# EAGLE design outdoor-sensor (EAGLE 7.4.0)

## Sheet 1 of 9: Pressure Sensor LPS25H Datasheet <http://www.st.com/st-web-ui/static/active/en/resource/technical/document/datasheet/DM00066332.pdf>
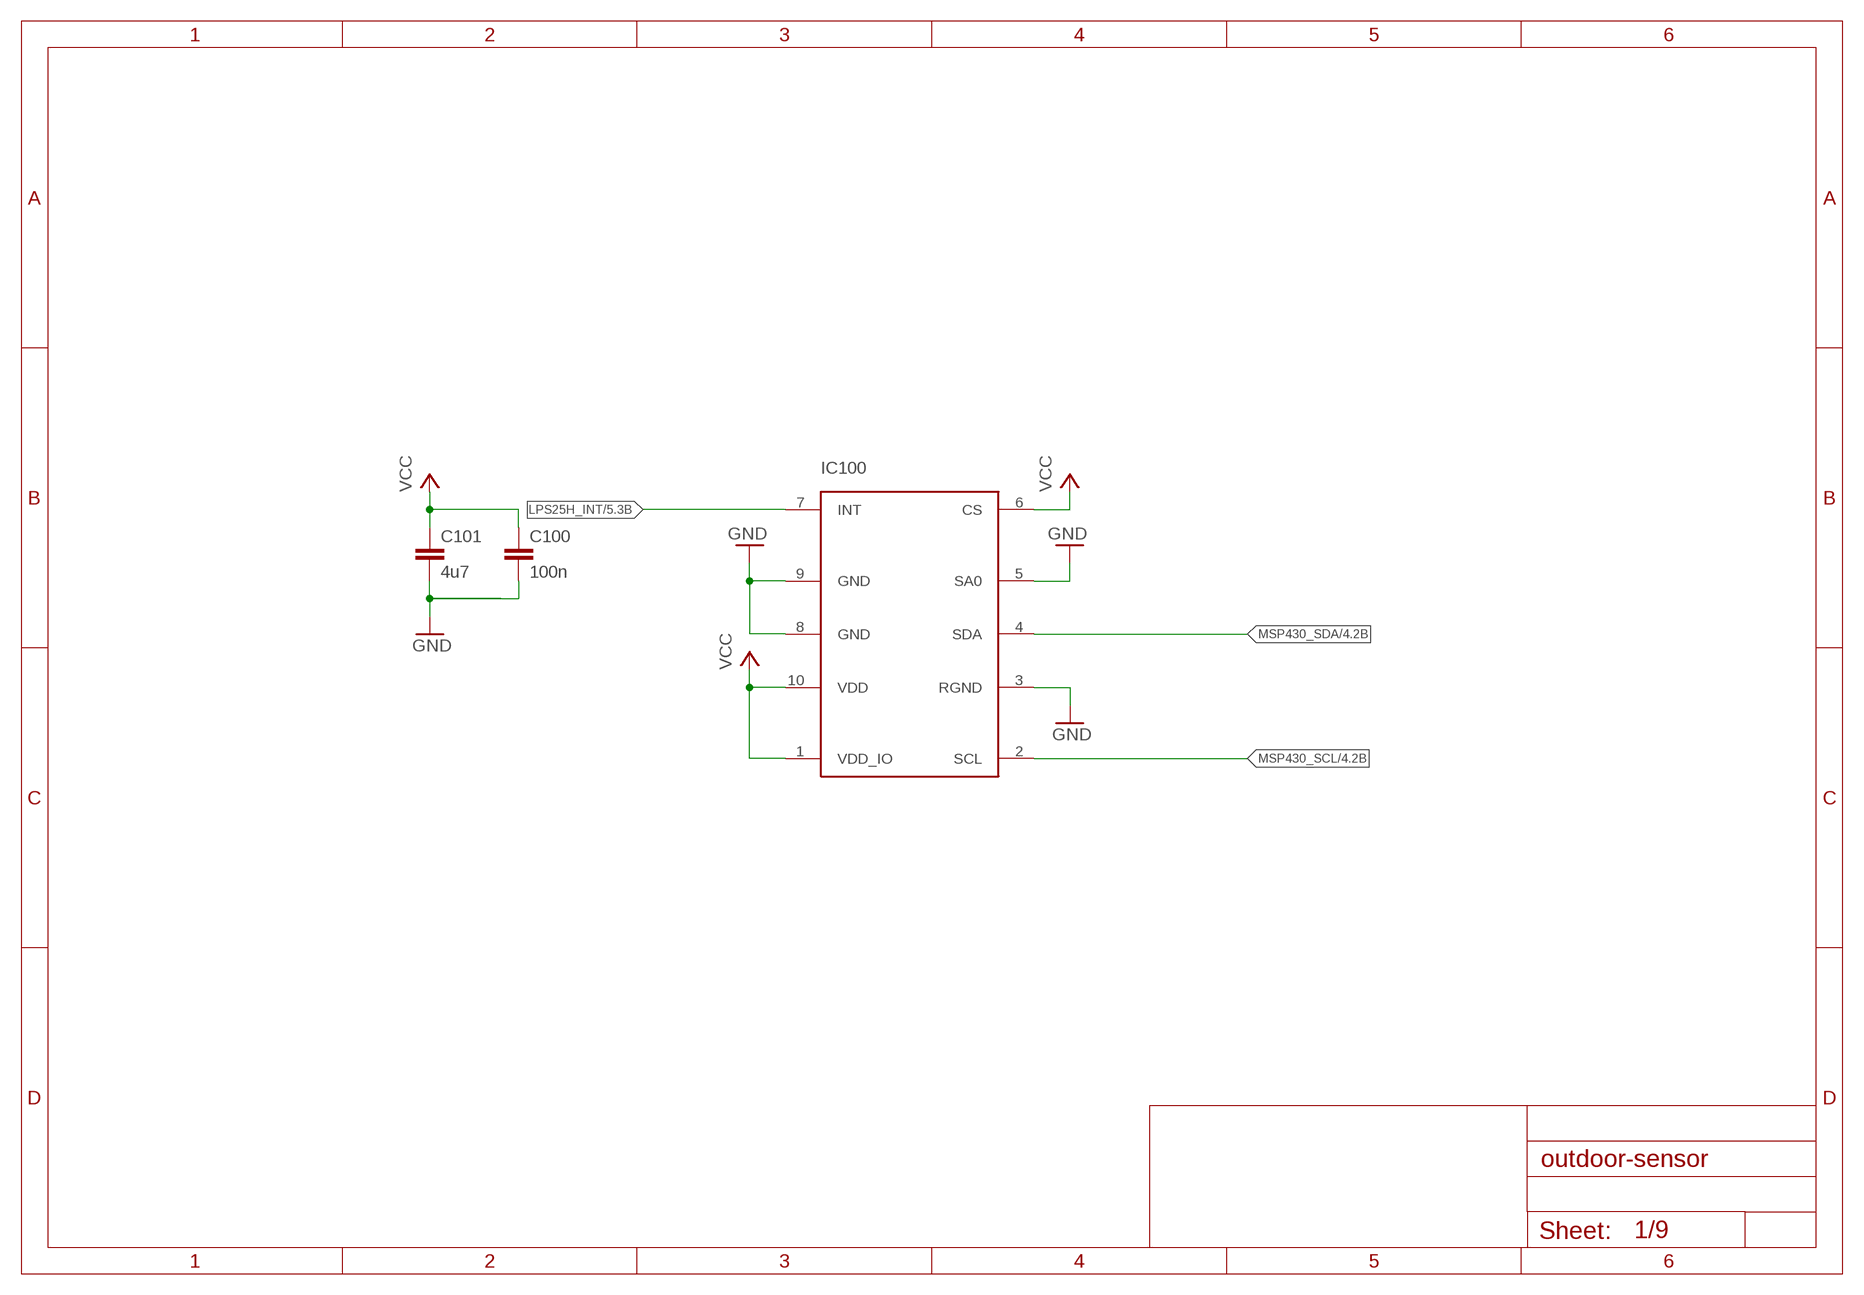
[diagram p0: schematic, sheet 1]

### Parts
C100  100n  C-EUC0603  [C0603]
C101  4u7  C-EUC0603  [C0603]
IC100  LPS25H  [LPS25H]

### Nets
GND: C100.2 C101.2 IC100.3(RGND) IC100.5(SA0) IC100.8(GND) IC100.9(GND) ; also sheet 2,3,4,5,6,7,8,9
LPS25H_INT: IC100.7(INT) ; also sheet 5
MSP430_SCL: IC100.2(SCL) ; also sheet 4,5,6,8,9
MSP430_SDA: IC100.4(SDA) ; also sheet 4,5,6,8,9
VCC: C100.1 C101.1 IC100.1(VDD_IO) IC100.6(CS) IC100.10(VDD) ; also sheet 2,3,4,5,6,8

## Sheet 2 of 9: Charger and Buck BQ25570 Datasheet <http://www.ti.com/lit/ds/symlink/bq25570.pdf>
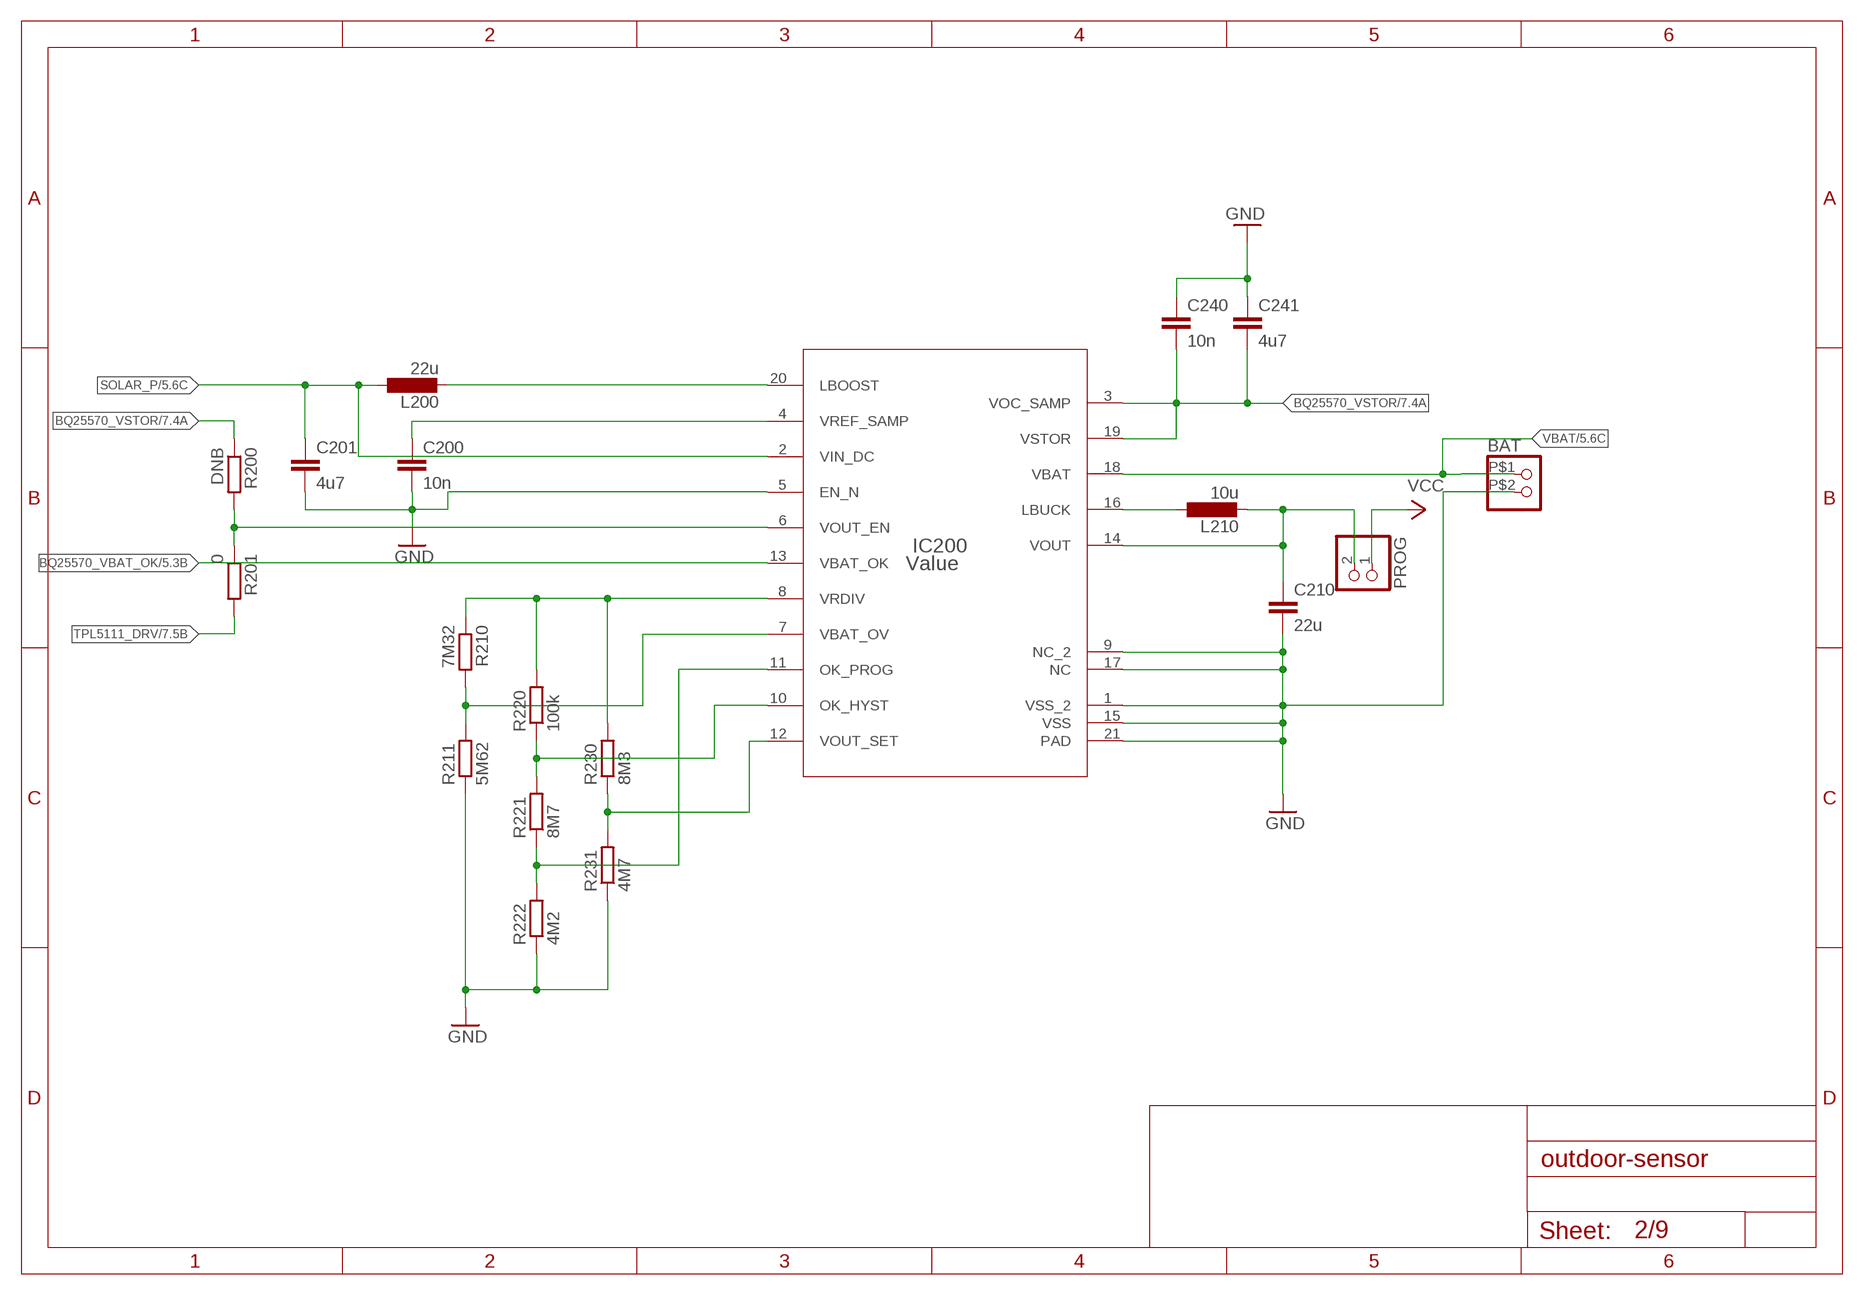
[diagram p1: schematic, sheet 2]

### Parts
!PROG  PINHD-1X2  [1X02]
BAT  PINHD-1X2IPBS-102-01-T-S-GP  [IPBS-102-01-T-S-GP]
C200  10n  C-EUC0603  [C0603]
C201  4u7  C-EUC0603  [C0603]
C210  22u  C-EUC0603  [C0603]
C240  10n  C-EUC0603  [C0603]
C241  4u7  C-EUC0603  [C0603]
IC200  Value  BQ25570RGRR  [RGR0020A]
L200  22u  L-EUL3944  [L3944]
L210  10u  L-EUM  [L2.5X2.0]
R200  DNB  R-EU_R0603  [R0603]
R201  0  R-EU_R0603  [R0603]
R210  7M32  R-EU_R0603  [R0603]
R211  5M62  R-EU_R0603  [R0603]
R220  100k  R-EU_R0603  [R0603]
R221  8M7  R-EU_R0603  [R0603]
R222  4M2  R-EU_R0603  [R0603]
R230  8M3  R-EU_R0603  [R0603]
R231  4M7  R-EU_R0603  [R0603]

### Nets
BQ25570_VBAT_OK: IC200.13(VBAT_OK) ; also sheet 5
BQ25570_VOUT_EN: IC200.6(VOUT_EN) R200.2 R201.1
BQ25570_VSTOR: C240.2 C241.2 IC200.3(VOC_SAMP) IC200.19(VSTOR) R200.1 ; also sheet 7
GND: BAT.P$2 C200.2 C201.2 C210.2 C240.1 C241.1 IC200.1(VSS_2) IC200.5(EN_N) IC200.9(NC_2) IC200.15(VSS) IC200.17(NC) IC200.21(PAD) R211.1 R222.1 R231.1 ; also sheet 1,3,4,5,6,7,8,9
N$14: IC200.10(OK_HYST) R220.1 R221.2
N$15: IC200.8(VRDIV) R210.1 R220.2 R230.2
N$16: IC200.7(VBAT_OV) R210.2 R211.2
N$17: IC200.11(OK_PROG) R221.1 R222.2
N$18: IC200.20(LBOOST) L200.P$2
N$19: C200.1 IC200.4(VREF_SAMP)
N$21: IC200.12(VOUT_SET) R230.1 R231.2
N$22: !PROG.2 C210.1 IC200.14(VOUT) L210.P$2
N$25: IC200.16(LBUCK) L210.P$1
SOLAR_P: C201.1 IC200.2(VIN_DC) L200.P$1 ; also sheet 5,8
TPL5111_DRV: R201.2 ; also sheet 7
VBAT: BAT.P$1 IC200.18(VBAT) ; also sheet 5,9
VCC: !PROG.1 ; also sheet 1,3,4,5,6,8

## Sheet 3 of 9: Sub 1-GHz Transceiver CC110L Datasheet <http://www.ti.com/lit/ds/symlink/bq25570.pdf>
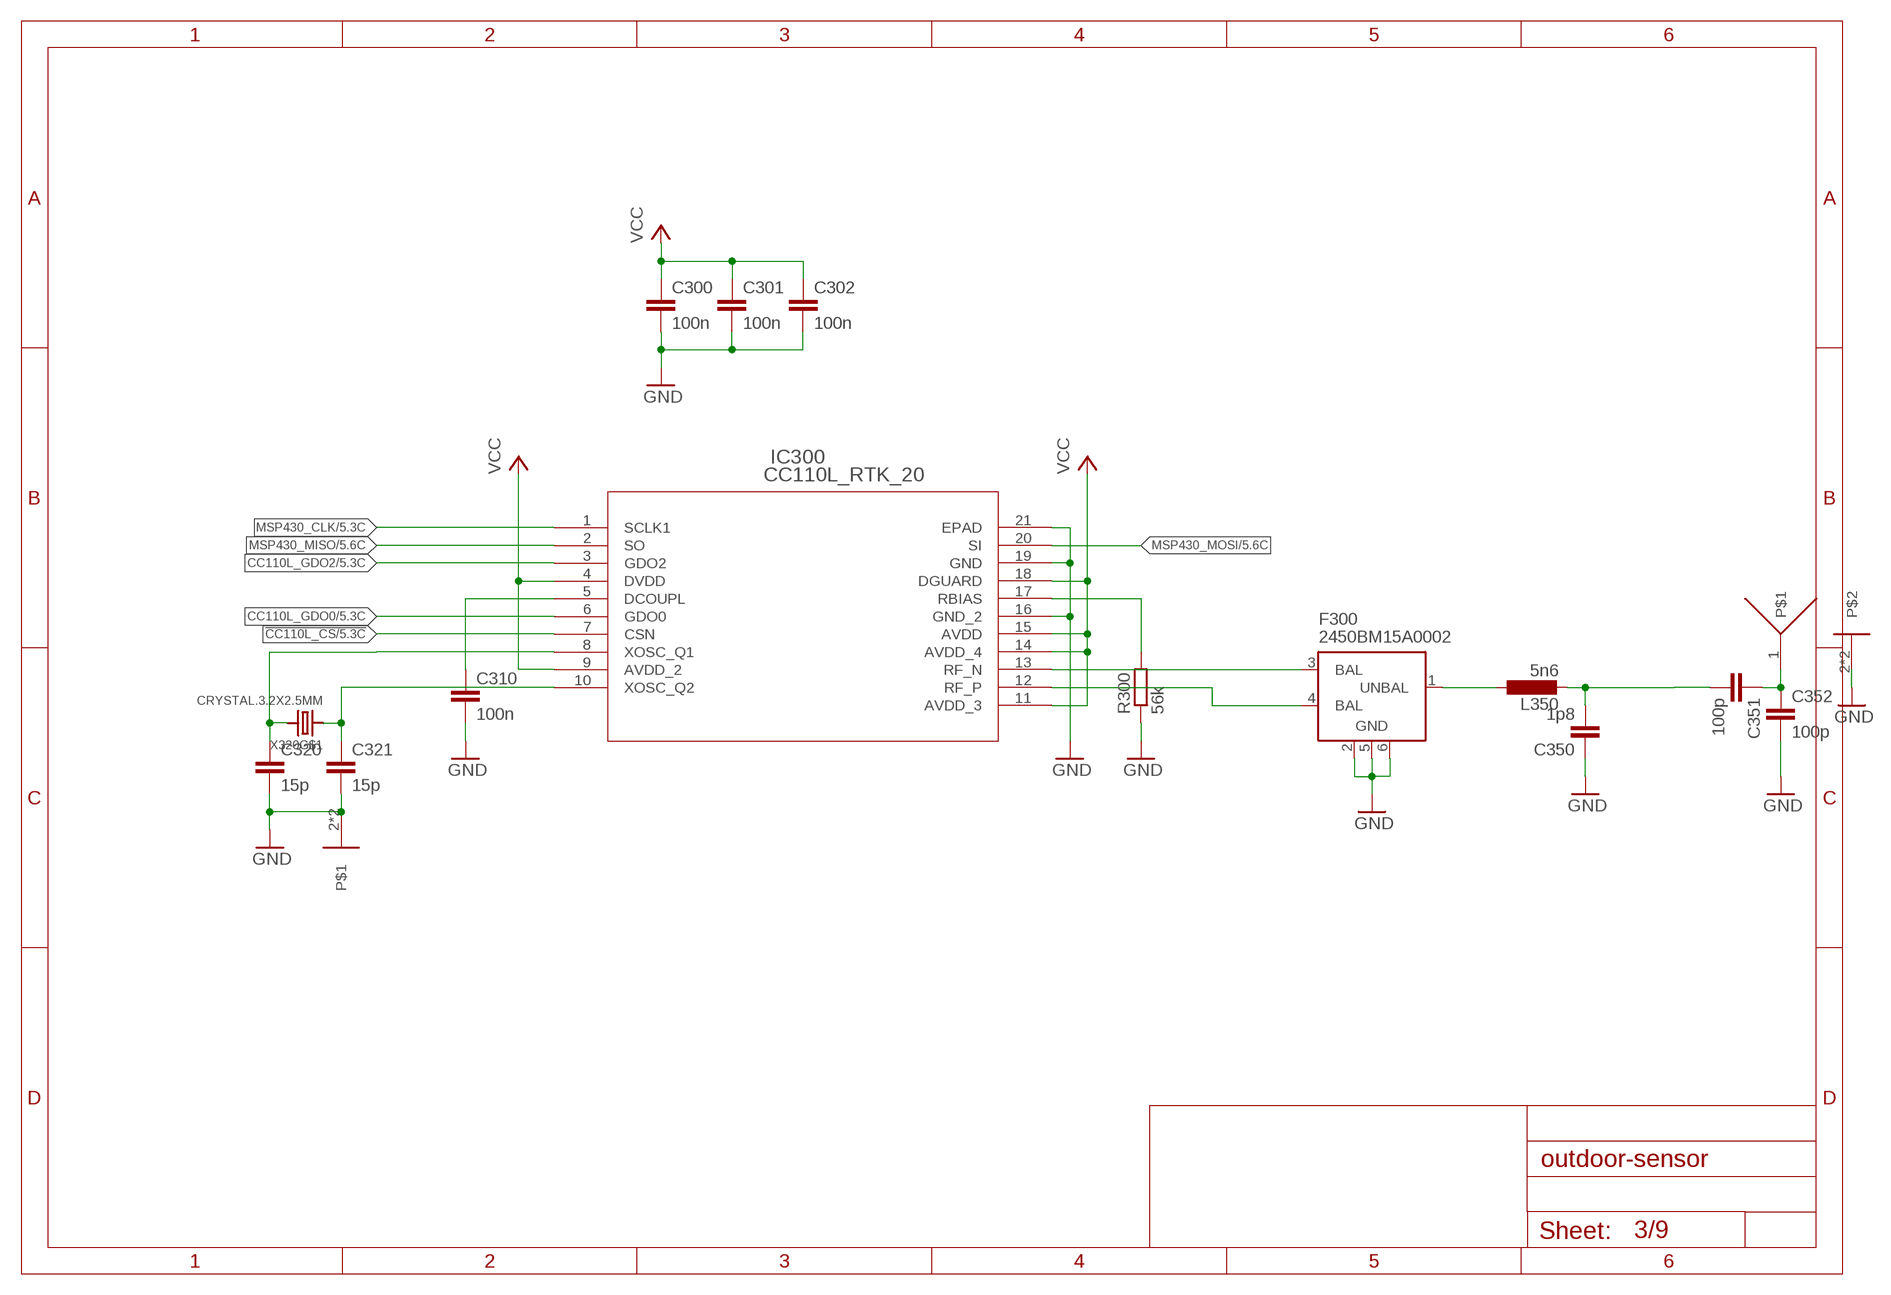
[diagram p2: schematic, sheet 3]

### Parts
C300  100n  C-EUC0603  [C0603]
C301  100n  C-EUC0603  [C0603]
C302  100n  C-EUC0603  [C0603]
C310  100n  C-EUC0603  [C0603]
C320  15p  C-EUC0603  [C0603]
C321  15p  C-EUC0603  [C0603]
C350  1p8  C-EUC0603K  [C0603K]
C351  100p  C-EUC0603  [C0603]
C352  100p  C-EUC0603K  [C0603K]
F300  2450BM15A0002  [2450BM15A0002]
IC300  CC110L_RTK_20  [RTK20_2P4X2P4]
L350  5n6  L-EUL2012C  [L2012C]
R300  56k  R-EU_R0603  [R0603]
U$1  ANTENNA868W3013-INV  [W3013-INV]
X320  CRYSTAL.3.2X2.5MM  [3.2X2.5MM]

### Nets
!CC110L_CS: IC300.7(CSN) ; also sheet 5
CC110L_GDO0: IC300.6(GDO0) ; also sheet 5
CC110L_GDO2: IC300.3(GDO2) ; also sheet 5
GND: C300.2 C301.2 C302.2 C310.2 C320.2 C321.2 C350.1 C352.2 F300.2(GND) F300.5(GND) F300.6(GND) IC300.16(GND_2) IC300.19(GND) IC300.21(EPAD) R300.1 U$1.2 U$1.3 X320.2 X320.4 ; also sheet 1,2,4,5,6,7,8,9
MSP430_CLK: IC300.1(SCLK1) ; also sheet 5
MSP430_MISO: IC300.2(SO) ; also sheet 5
MSP430_MOSI: IC300.20(SI) ; also sheet 5
N$1: C351.1 C352.1 U$1.1
N$2: F300.1(UNBAL) L350.1
N$29: C320.1 IC300.8(XOSC_Q1) X320.3
N$34: F300.3(BAL) IC300.13(RF_N)
N$35: F300.4(BAL) IC300.12(RF_P)
N$36: C350.2 C351.2 L350.2
N$40: C310.1 IC300.5(DCOUPL)
N$41: IC300.17(RBIAS) R300.2
N$49: C321.1 IC300.10(XOSC_Q2) X320.1
VCC: C300.1 C301.1 C302.1 IC300.4(DVDD) IC300.9(AVDD_2) IC300.11(AVDD_3) IC300.14(AVDD_4) IC300.15(AVDD) IC300.18(DGUARD) ; also sheet 1,2,4,5,6,8

## Sheet 4 of 9: Humidity/Temperature Sensor HDC1000 Datasheet <http://www.ti.com/lit/ds/symlink/hdc1000.pdf>
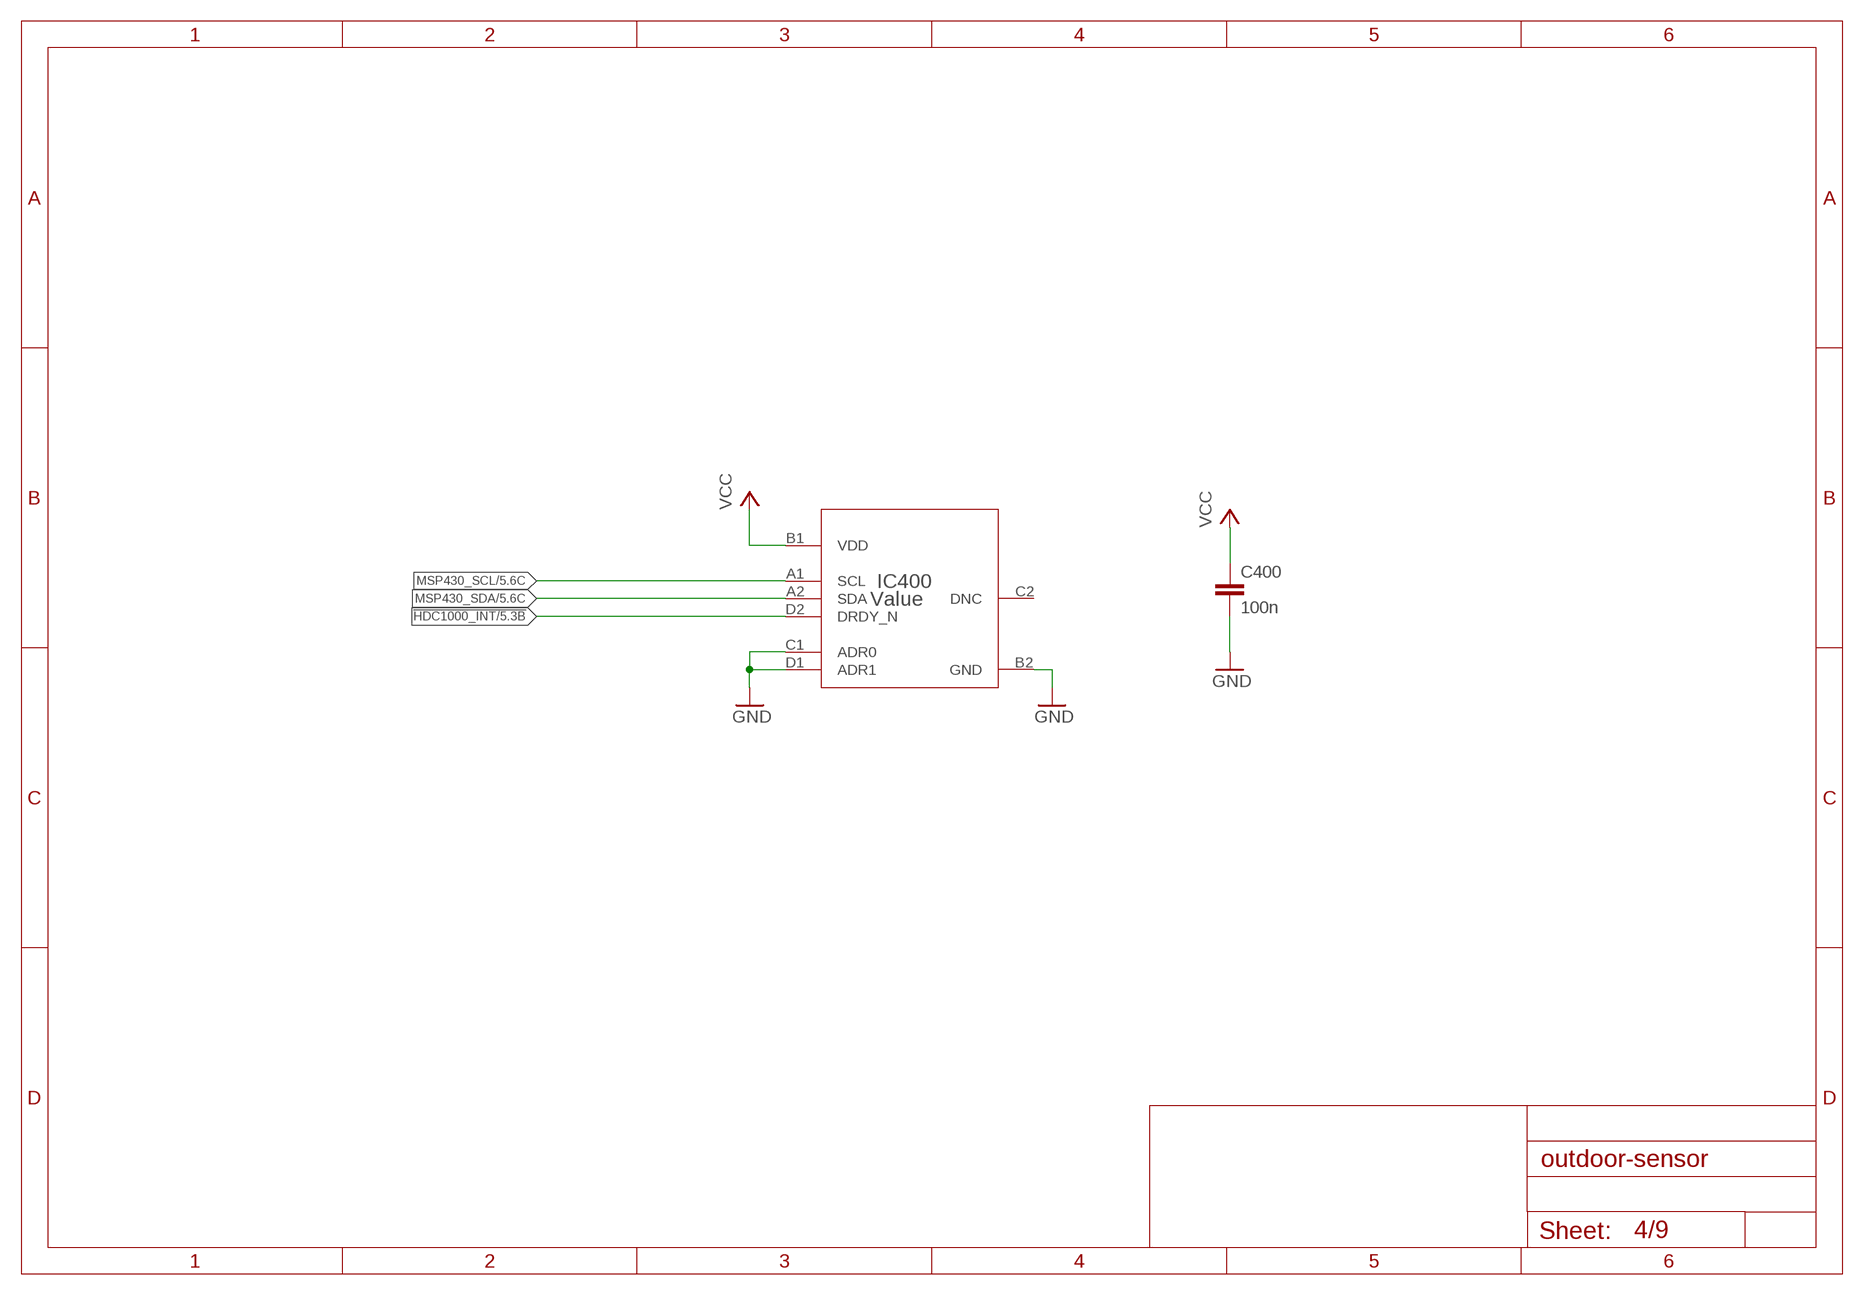
[diagram p3: schematic, sheet 4]

### Parts
C400  100n  C-EUC0603  [C0603]
IC400  Value  HDC1000YPAR  [YPA0008AGAE]

### Nets
!HDC1000_INT: IC400.D2(DRDY_N) ; also sheet 5
GND: C400.2 IC400.B2(GND) IC400.C1(ADR0) IC400.D1(ADR1) ; also sheet 1,2,3,5,6,7,8,9
MSP430_SCL: IC400.A1(SCL) ; also sheet 1,5,6,8,9
MSP430_SDA: IC400.A2(SDA) ; also sheet 1,5,6,8,9
VCC: C400.1 IC400.B1(VDD) ; also sheet 1,2,3,5,6,8
Unconnected: IC400.C2(DNC)

## Sheet 5 of 9: Mikrocontroller
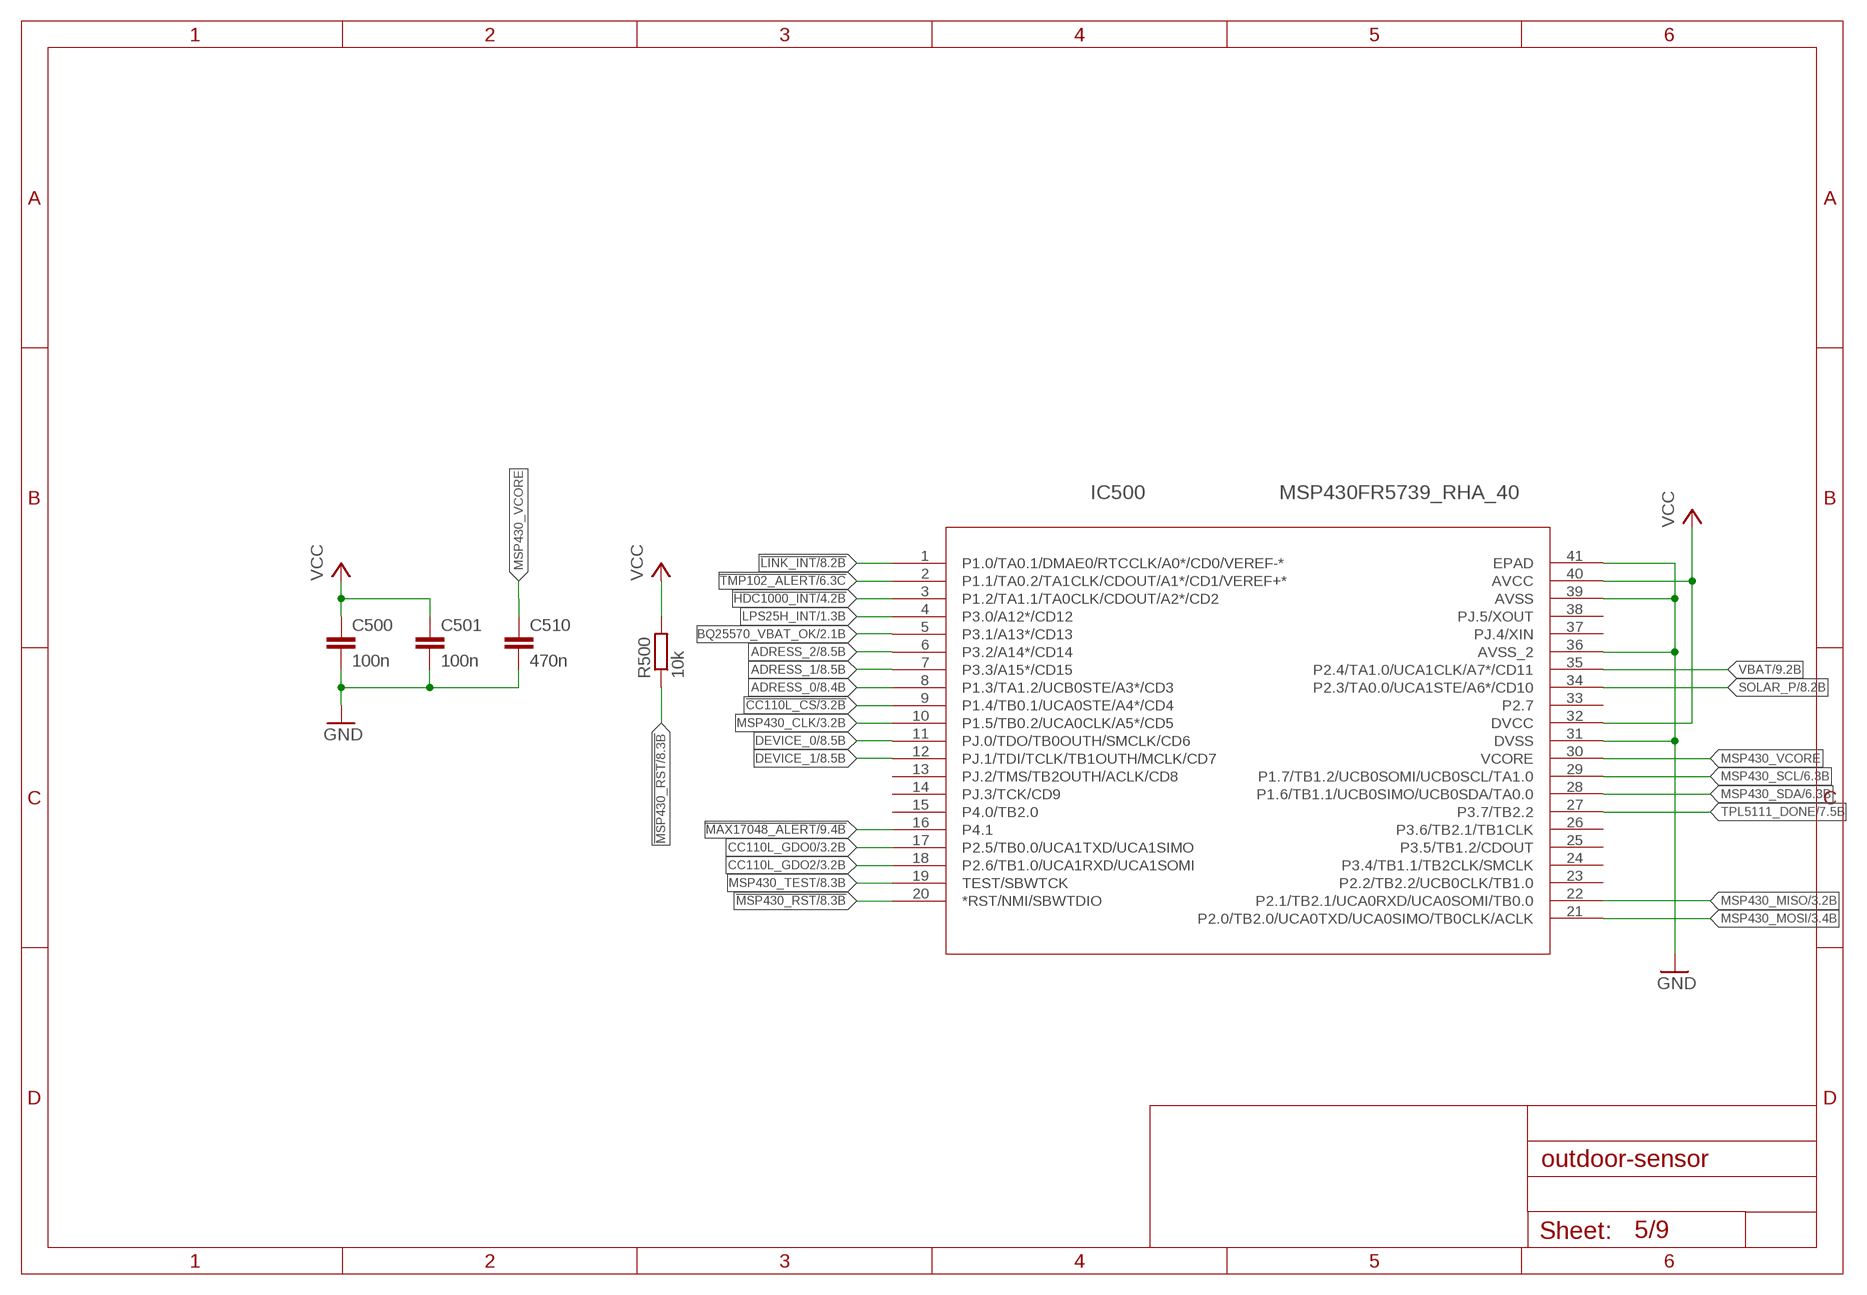
[diagram p4: schematic, sheet 5]

### Parts
C500  100n  C-EUC0603  [C0603]
C501  100n  C-EUC0603  [C0603]
C510  470n  C-EUC0603  [C0603]
IC500  MSP430FR5739_RHA_40  [RHA40_2P9X2P9]
R500  10k  R-EU_R0603  [R0603]

### Nets
!CC110L_CS: IC500.9(P1.4/TB0.1/UCA0STE/A4*/CD4) ; also sheet 3
!HDC1000_INT: IC500.3(P1.2/TA1.1/TA0CLK/CDOUT/A2*/CD2) ; also sheet 4
!LINK_INT: IC500.1(P1.0/TA0.1/DMAE0/RTCCLK/A0*/CD0/VEREF-*) ; also sheet 8
!MAX17048_ALERT: IC500.16(P4.1) ; also sheet 9
!MSP430_RST: IC500.20(*RST/NMI/SBWTDIO) R500.1 ; also sheet 8
!TMP102_ALERT: IC500.2(P1.1/TA0.2/TA1CLK/CDOUT/A1*/CD1/VEREF+*) ; also sheet 6
ADRESS_0: IC500.8(P1.3/TA1.2/UCB0STE/A3*/CD3) ; also sheet 8
ADRESS_1: IC500.7(P3.3/A15*/CD15) ; also sheet 8
ADRESS_2: IC500.6(P3.2/A14*/CD14) ; also sheet 8
BQ25570_VBAT_OK: IC500.5(P3.1/A13*/CD13) ; also sheet 2
CC110L_GDO0: IC500.17(P2.5/TB0.0/UCA1TXD/UCA1SIMO) ; also sheet 3
CC110L_GDO2: IC500.18(P2.6/TB1.0/UCA1RXD/UCA1SOMI) ; also sheet 3
DEVICE_0: IC500.11(PJ.0/TDO/TB0OUTH/SMCLK/CD6) ; also sheet 8
DEVICE_1: IC500.12(PJ.1/TDI/TCLK/TB1OUTH/MCLK/CD7) ; also sheet 8
GND: C500.2 C501.2 C510.2 IC500.31(DVSS) IC500.36(AVSS_2) IC500.39(AVSS) IC500.41(EPAD) ; also sheet 1,2,3,4,6,7,8,9
LPS25H_INT: IC500.4(P3.0/A12*/CD12) ; also sheet 1
MSP430_CLK: IC500.10(P1.5/TB0.2/UCA0CLK/A5*/CD5) ; also sheet 3
MSP430_MISO: IC500.22(P2.1/TB2.1/UCA0RXD/UCA0SOMI/TB0.0) ; also sheet 3
MSP430_MOSI: IC500.21(P2.0/TB2.0/UCA0TXD/UCA0SIMO/TB0CLK/ACLK) ; also sheet 3
MSP430_SCL: IC500.29(P1.7/TB1.2/UCB0SOMI/UCB0SCL/TA1.0) ; also sheet 1,4,6,8,9
MSP430_SDA: IC500.28(P1.6/TB1.1/UCB0SIMO/UCB0SDA/TA0.0) ; also sheet 1,4,6,8,9
MSP430_TEST: IC500.19(TEST/SBWTCK) ; also sheet 8
MSP430_VCORE: C510.1 IC500.30(VCORE)
SOLAR_P: IC500.34(P2.3/TA0.0/UCA1STE/A6*/CD10) ; also sheet 2,8
TPL5111_DONE: IC500.27(P3.7/TB2.2) ; also sheet 7
VBAT: IC500.35(P2.4/TA1.0/UCA1CLK/A7*/CD11) ; also sheet 2,9
VCC: C500.1 C501.1 IC500.32(DVCC) IC500.40(AVCC) R500.2 ; also sheet 1,2,3,4,6,8
Unconnected: IC500.13(PJ.2/TMS/TB2OUTH/ACLK/CD8) IC500.14(PJ.3/TCK/CD9) IC500.15(P4.0/TB2.0) IC500.23(P2.2/TB2.2/UCB0CLK/TB1.0) IC500.24(P3.4/TB1.1/TB2CLK/SMCLK) IC500.25(P3.5/TB1.2/CDOUT) IC500.26(P3.6/TB2.1/TB1CLK) IC500.33(P2.7) IC500.37(PJ.4/XIN) IC500.38(PJ.5/XOUT)

## Sheet 6 of 9: Temperature Sensor TMP102-Q1 Datasheet <http://www.ti.com/lit/ds/symlink/tmp102-q1.pdf>
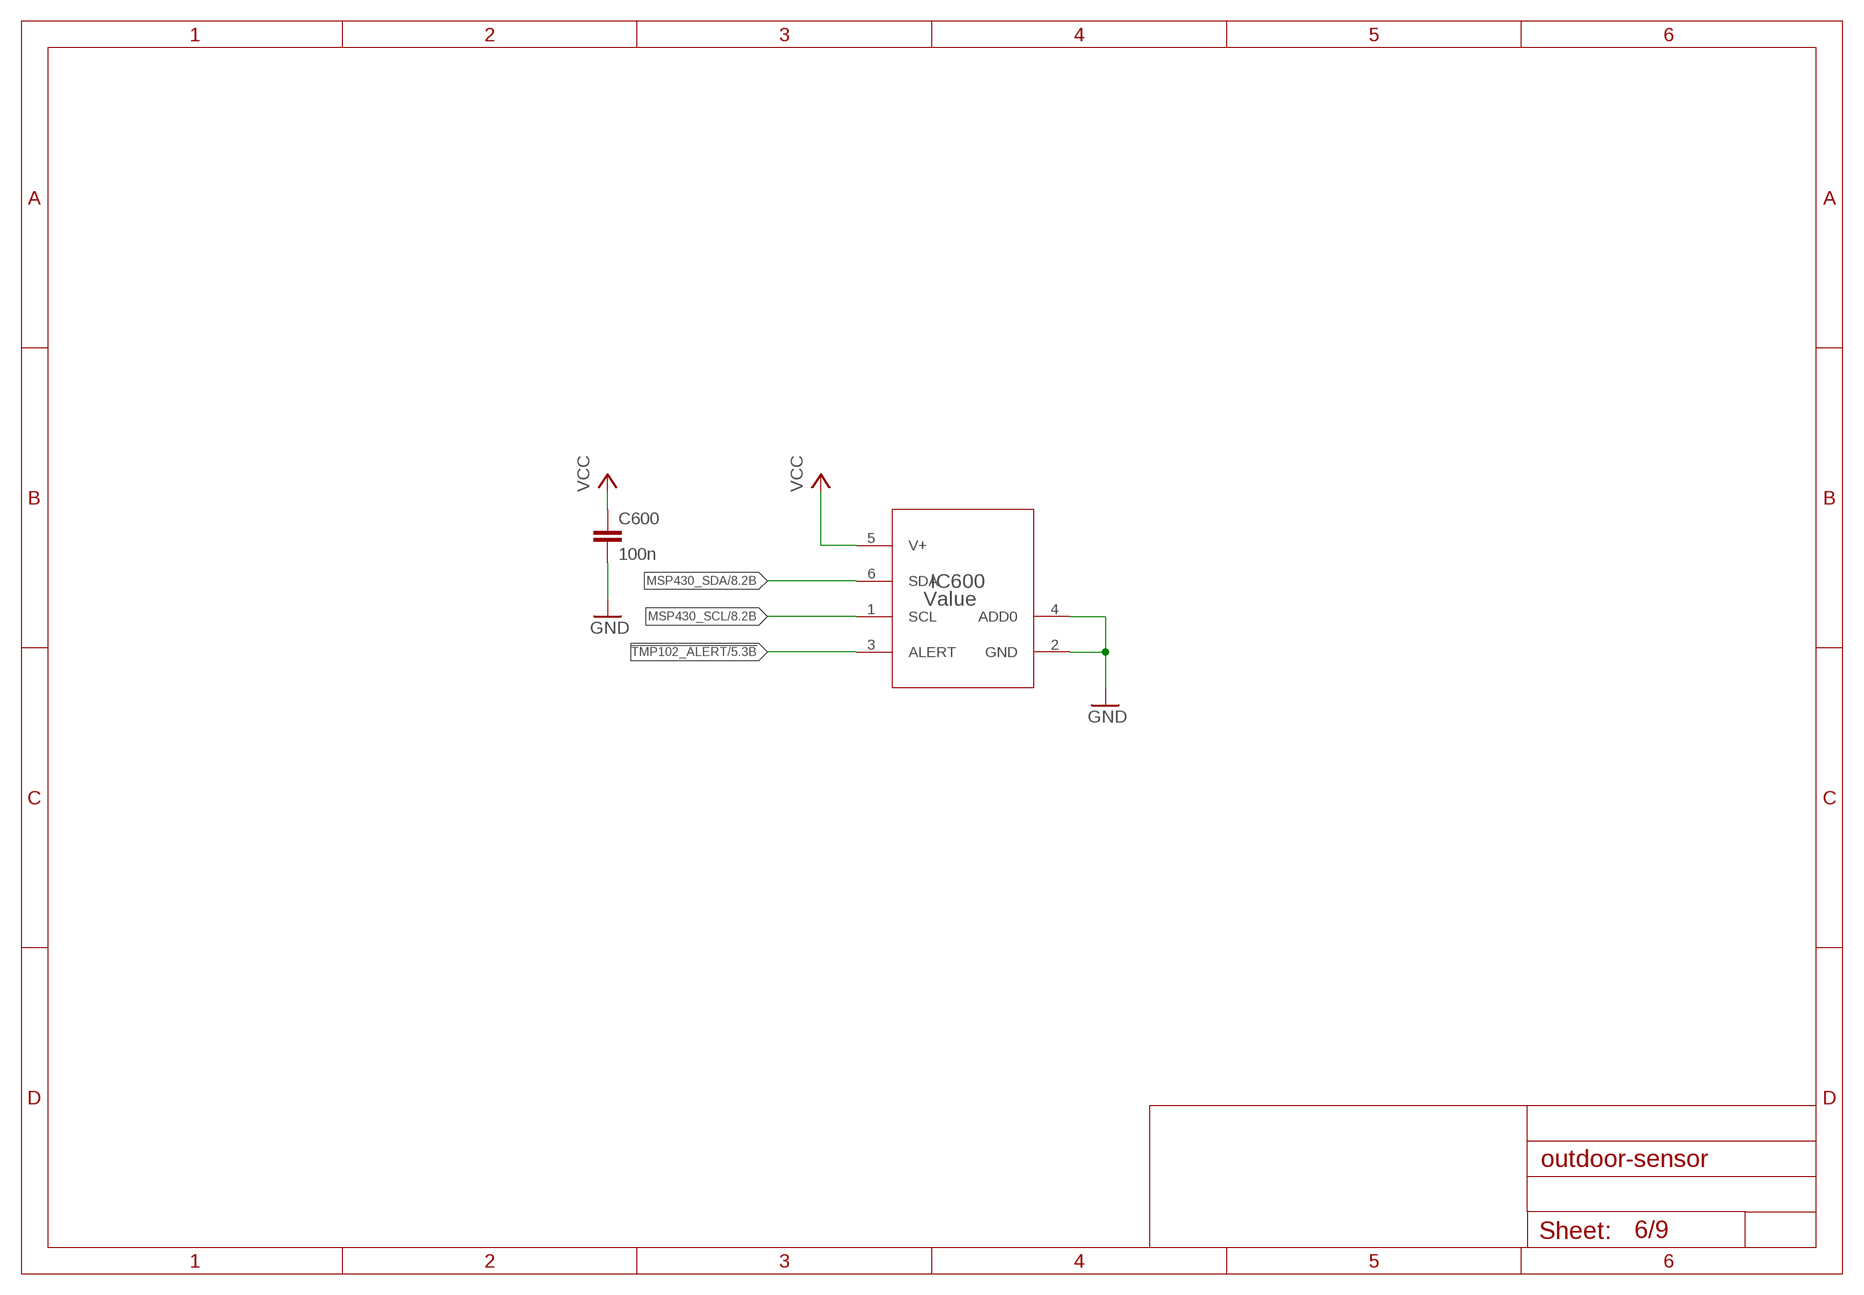
[diagram p5: schematic, sheet 6]

### Parts
C600  100n  C-EUC0603  [C0603]
IC600  Value  TMP102AQDRLRQ1  [DRL0006A]

### Nets
!TMP102_ALERT: IC600.3(ALERT) ; also sheet 5
GND: C600.2 IC600.2(GND) IC600.4(ADD0) ; also sheet 1,2,3,4,5,7,8,9
MSP430_SCL: IC600.1(SCL) ; also sheet 1,4,5,8,9
MSP430_SDA: IC600.6(SDA) ; also sheet 1,4,5,8,9
VCC: C600.1 IC600.5(V+) ; also sheet 1,2,3,4,5,8

## Sheet 7 of 9: Nano low power timer TPL5010 Datasheet <http://www.ti.com/lit/ds/symlink/tpl5010.pdf>
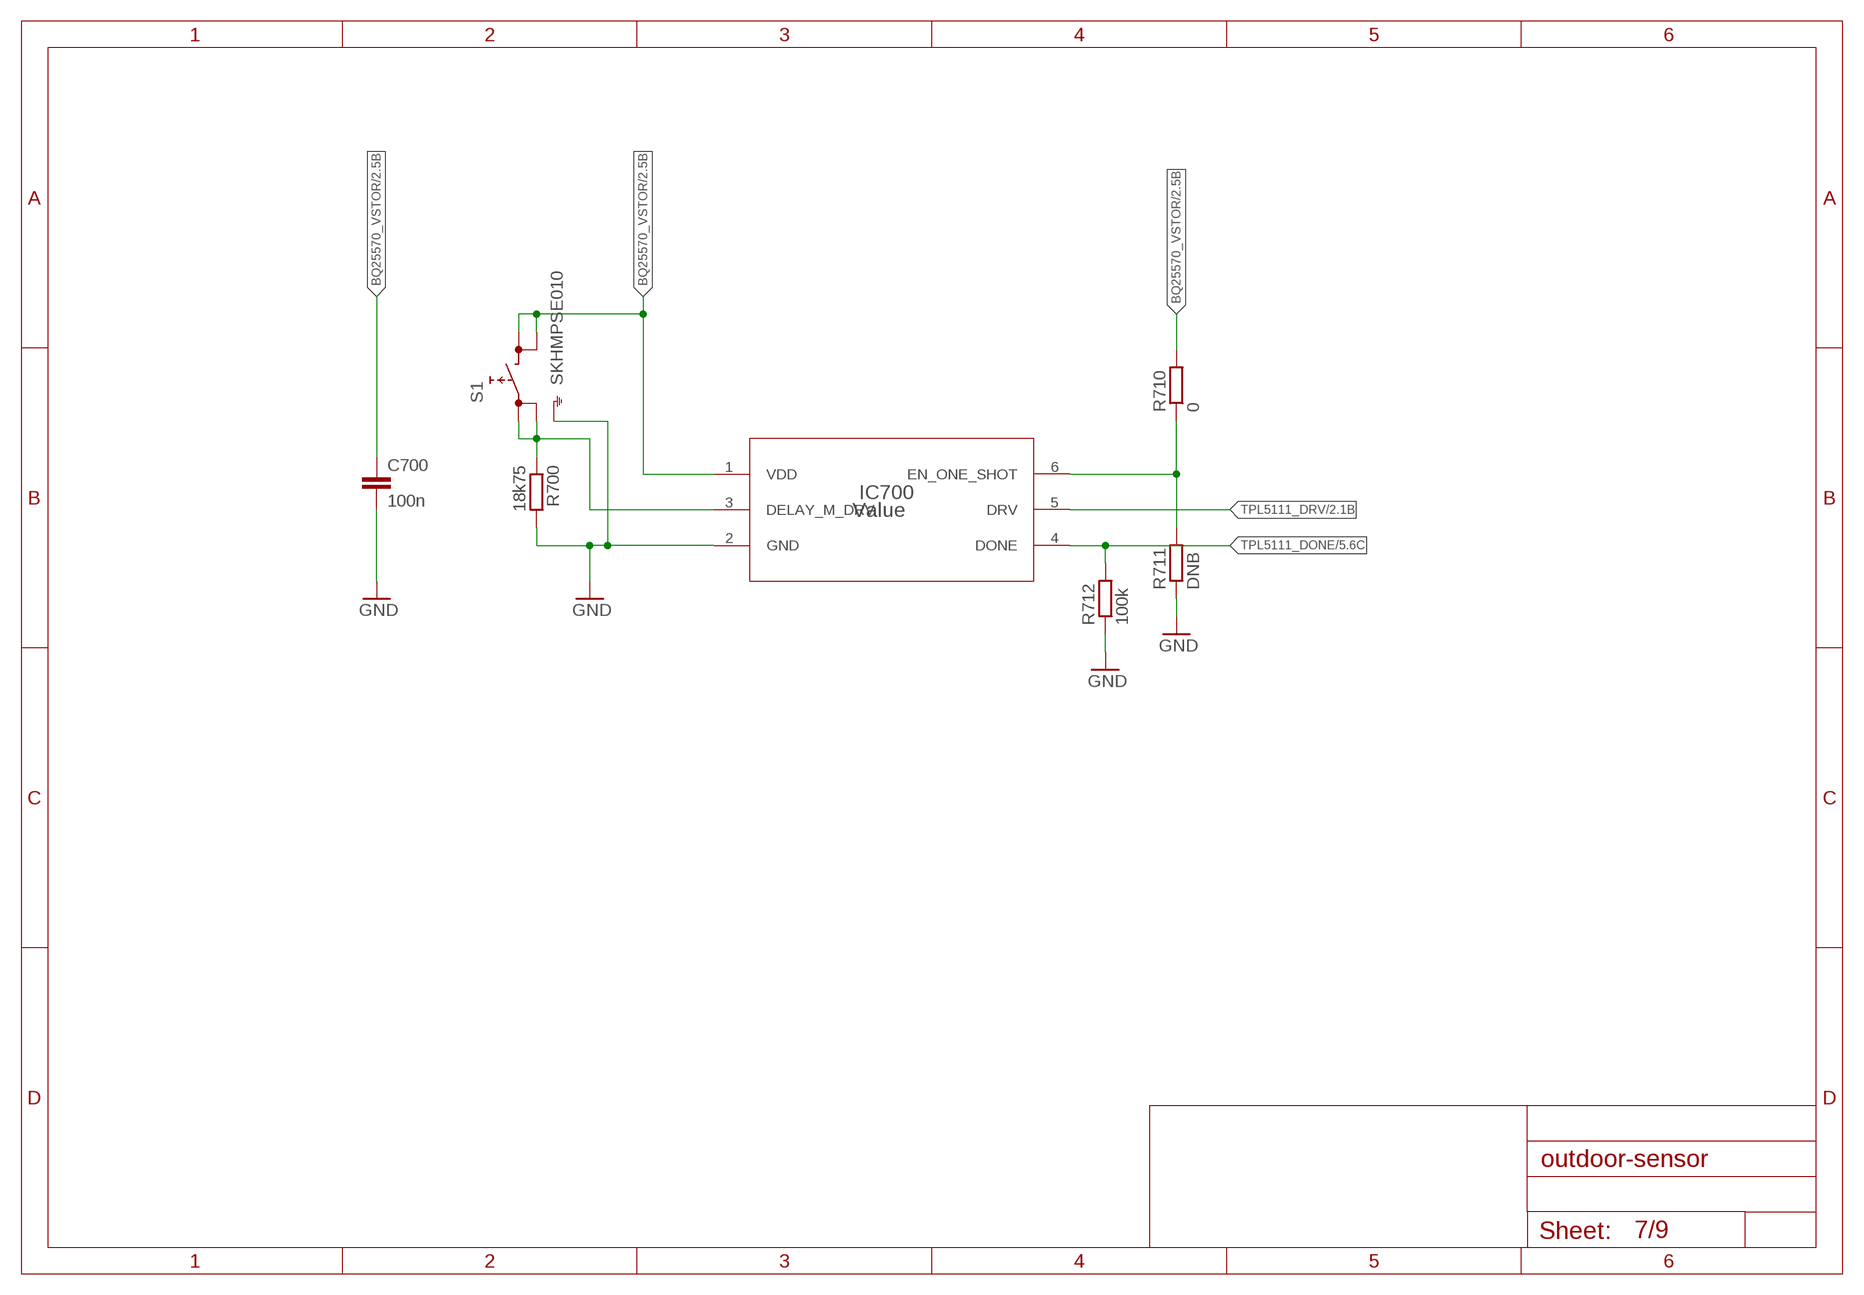
[diagram p6: schematic, sheet 7]

### Parts
C700  100n  C-EUC0603  [C0603]
IC700  Value  TPL5110DDCR  [DDC0006A_N]
R700  18k75  R-EU_R0603  [R0603]
R710  0  R-EU_R0603  [R0603]
R711  DNB  R-EU_R0603  [R0603]
R712  100k  R-EU_R0603  [R0603]
S1  SKHMPSE010  [SKHMPXE010]

### Nets
BQ25570_VSTOR: C700.1 IC700.1(VDD) R710.2 S1.3(2.1) S1.4(2.2) ; also sheet 2
GND: C700.2 IC700.2(GND) R700.2 R711.1 R712.1 S1.5(SH) ; also sheet 1,2,3,4,5,6,8,9
N$7: IC700.3(DELAY_M_DRV) R700.1 S1.1(1.1) S1.2(1.2)
TPL5010_RST_N: IC700.6(EN_ONE_SHOT) R710.1 R711.2
TPL5111_DONE: IC700.4(DONE) R712.2 ; also sheet 5
TPL5111_DRV: IC700.5(DRV) ; also sheet 2

## Sheet 8 of 9: Connectors
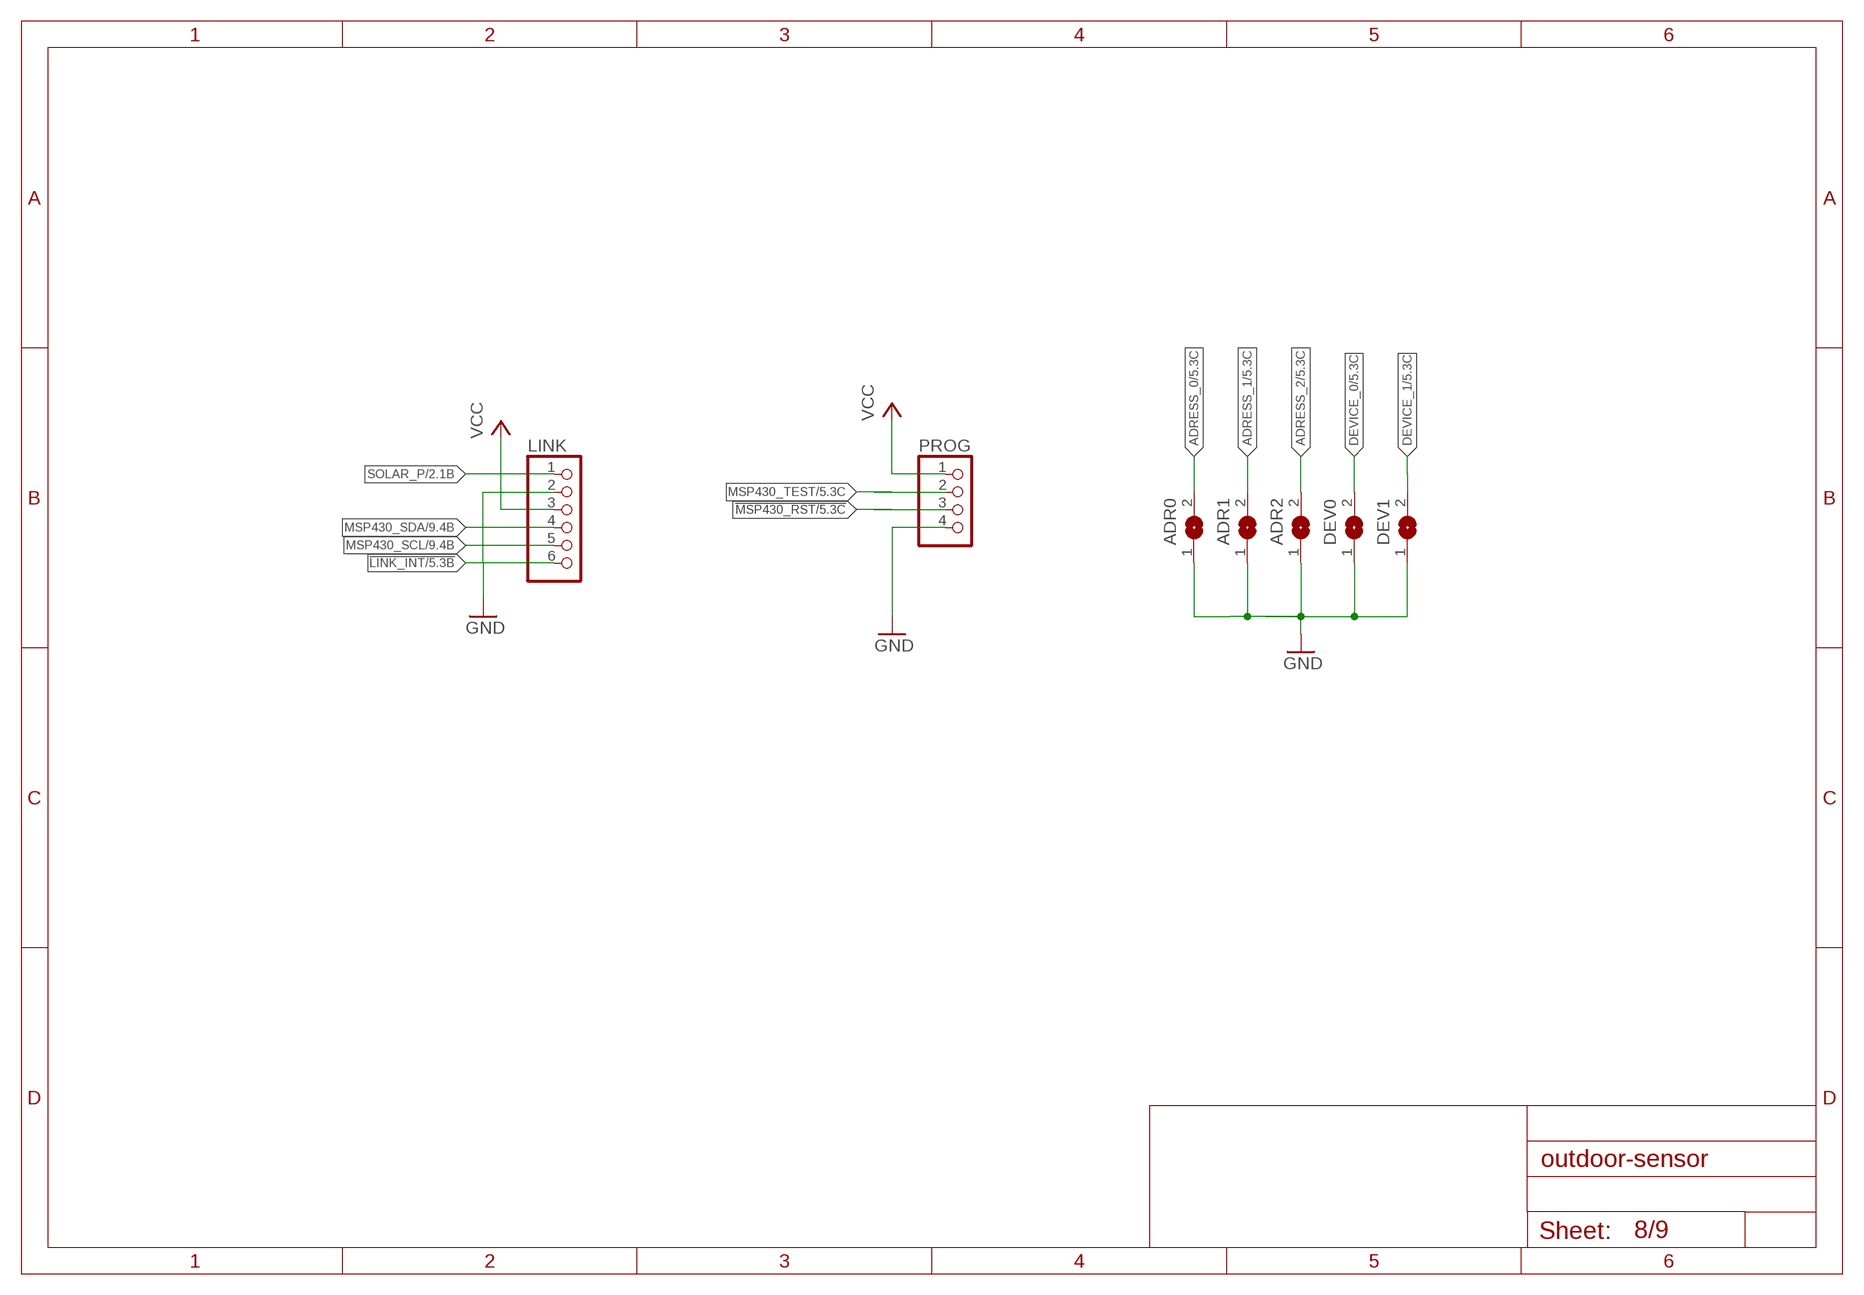
[diagram p7: schematic, sheet 8]

### Parts
ADR0  SJW  [SJW]
ADR1  SJW  [SJW]
ADR2  SJW  [SJW]
DEV0  SJW  [SJW]
DEV1  SJW  [SJW]
LINK  PINHD-1X6  [1X06]
PROG  PINHD-1X4  [1X04]

### Nets
!LINK_INT: LINK.6 ; also sheet 5
!MSP430_RST: PROG.3 ; also sheet 5
ADRESS_0: ADR0.2 ; also sheet 5
ADRESS_1: ADR1.2 ; also sheet 5
ADRESS_2: ADR2.2 ; also sheet 5
DEVICE_0: DEV0.2 ; also sheet 5
DEVICE_1: DEV1.2 ; also sheet 5
GND: ADR0.1 ADR1.1 ADR2.1 DEV0.1 DEV1.1 LINK.2 PROG.4 ; also sheet 1,2,3,4,5,6,7,9
MSP430_SCL: LINK.5 ; also sheet 1,4,5,6,9
MSP430_SDA: LINK.4 ; also sheet 1,4,5,6,9
MSP430_TEST: PROG.2 ; also sheet 5
SOLAR_P: LINK.1 ; also sheet 2,5
VCC: LINK.3 PROG.1 ; also sheet 1,2,3,4,5,6

## Sheet 9 of 9
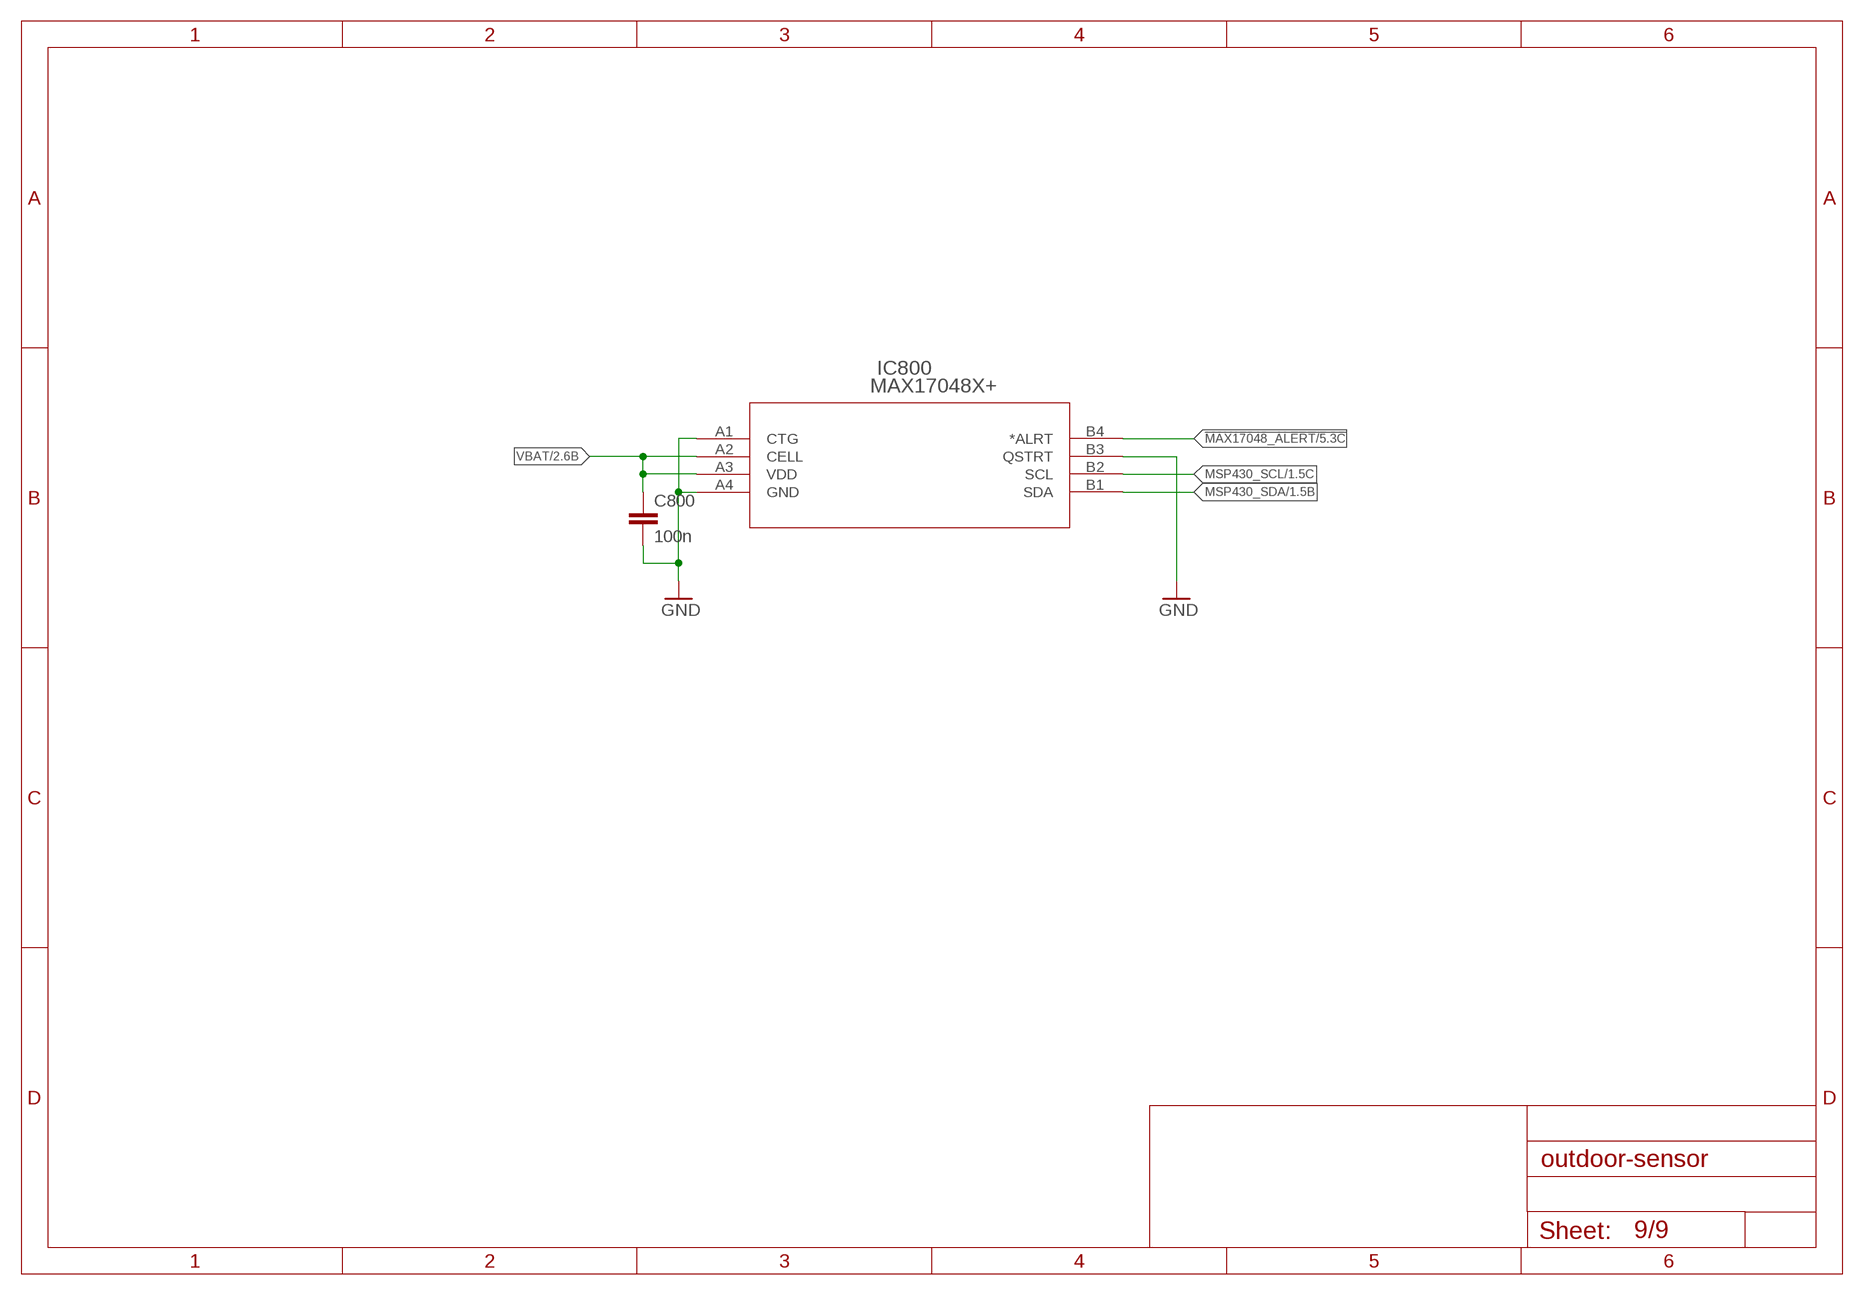
[diagram p8: schematic, sheet 9]

### Parts
C800  100n  C-EUC0603  [C0603]
IC800  MAX17048X+  [21-0555B_W80B1-1]

### Nets
!MAX17048_ALERT: IC800.B4(*ALRT) ; also sheet 5
GND: C800.2 IC800.A1(CTG) IC800.A4(GND) IC800.B3(QSTRT) ; also sheet 1,2,3,4,5,6,7,8
MSP430_SCL: IC800.B2(SCL) ; also sheet 1,4,5,6,8
MSP430_SDA: IC800.B1(SDA) ; also sheet 1,4,5,6,8
VBAT: C800.1 IC800.A2(CELL) IC800.A3(VDD) ; also sheet 2,5

## Library data of the parts
!PROG BAT = pinhead:PINHD-1X2: PIN HEADER; OC_FARNELL: unknown
ADR0 ADR1 ADR2 DEV0 DEV1 = jumper:SJ: SMD solder JUMPER; OC_FARNELL: unknown
C100 C300-C302 C310 C400 C500 C501 C600 C700 = rcl:C-EU: CAPACITOR, European symbol; MF: STMICROELECTRONICS; MPN: STP100NF04; OC_FARNELL: 9935509
C101 C200 C201 C240 C241 C320 C321 C350-C352 C510 = rcl:C-EU: CAPACITOR, European symbol; OC_FARNELL: unknown
C210 = rcl:C-EU: CAPACITOR, European symbol; MF: AVX; MPN: 06034D226MAT2A; OC_FARNELL: 2094041
C800 = rcl:C-EU: CAPACITOR, European symbol
F300 = johanson-technology:2450BM15A0002: 2.45 GHz Impedance Matched Balun-Filter For TI CC253X/CC2540 Chipset family Data sheet <http://www.johansontechnology.com/images/stories/ip/baluns/balun_filter_combo_matched_2450bm15a0002_v8.pdf>; OC_FARNELL: unknown
IC100 = weather_station:LPS25H: ST-Micro Piezoresistive pressure sensor; DIGIKEY: 497-15070-1-ND; MF: STMICROELECTRONICS; MPN: LPS25HBTR; OC_FARNELL: 2474251
IC200 = weather_station:BQ25570RGRR; ALTERNATEPARTNUMBER: BQ25570RGRT; APPLICATION_BUILDNUMBER: *; COMPTYPE: IC; MANUFACTURER: Texas Instruments; MOUNTTYPE: SMT; OC_FARNELL: unknown; PACKAGEREFERENCE: RGR0020A; PARTNUMBER: BQ25570RGRR; PIN_COUNT: 21; REFDES: RefDes; ROHS: Y; TYPE: TYPE
IC300 = weather_station:CC110L_RTK_20; DATASHEETURL: http://www.ti.com/lit/gpn/CC110L; DESCRIPTION: Value Line Transceiver; FAMILY_NAME: SUB-1 GHZ; GENERIC_PART_NUMBER: CC110L; INDUSTRY_STD_PKG_TYPE: VQFN; MANUFACTURER: Texas Instruments; OC_FARNELL: unknown; PACKAGE_DESIGNATOR: RTK; PIN_COUNT: 20
IC400 = weather_station:HDC1000YPAR; ALTERNATEPARTNUMBER: HDC1000YPAT; COMPTYPE: IC; MANUFACTURER: Texas Instruments; MOUNTTYPE: SMT; OC_FARNELL: unknown; PACKAGEREFERENCE: YPA0008AGAE; PARTNUMBER: HDC1000YPAR; PIN_COUNT: 8; REFDES: RefDes; ROHS: Y; TYPE: TYPE
IC500 = weather_station:MSP430FR5739_RHA_40; DATASHEETURL: http://www.ti.com/lit/gpn/MSP430FR5739; DESCRIPTION: MSP430FR573x,MSP430FR572x Mixed Signal Microcontroller; FAMILY_NAME: FRAM Series; GENERIC_PART_NUMBER: MSP430FR5739; INDUSTRY_STD_PKG_TYPE: VQFN; MANUFACTURER: Texas Instruments; MANUFACTURER_PART_NUMBER: msp430fr5739_rha_40; OC_FARNELL: unknown; PACKAGE_DESIGNATOR: RHA; PIN_COUNT: 40; VENDOR: Texas Instruments
IC600 = weather_station:TMP102AQDRLRQ1; COMPTYPE: IC; MANUFACTURER: Texas Instruments; MOUNTTYPE: SMT; OC_FARNELL: unknown; PACKAGEREFERENCE: DRL0006A; PARTNUMBER: TMP102AQDRLRQ1; PIN_COUNT: 6; REFDES: RefDes; ROHS: Y; TYPE: TYPE
IC700 = weather_station:TPL5110DDCR; COMPTYPE: IC; MANUFACTURER: Texas Instruments; MOUNTTYPE: SMT; OC_FARNELL: unknown; PACKAGEREFERENCE: DDC0006A; PARTNUMBER: TPL5110DDC; PIN_COUNT: 6; REFDES: RefDes; ROHS: Y; TYPE: TYPE
IC800 = weather_station:MAX17048X+; MANUFACTURER_PART_NUMBER: max17048x+; VENDOR: MAXIM
L200 L210 L350 = rcl:L-EU: INDUCTOR, European symbol; OC_FARNELL: unknown
LINK = pinhead:PINHD-1X6: PIN HEADER; OC_FARNELL: unknown
PROG = pinhead:PINHD-1X4: PIN HEADER; OC_FARNELL: unknown
R200 R201 R210 R211 R220-R222 R230 R231 R300 R500 R700 R710-R712 = rcl:R-EU_: RESISTOR, European symbol; OC_FARNELL: unknown
S1 = switch:SKHMP*E010: 6.2 X 6.5mm TACT Switch (SMD) Source: http://www3.alps.co.jp/WebObjects/catalog.woa/PDF/E/Switch/Tact/SKHM/SKHM.PDF; OC_FARNELL: unknown
U$1 = weather_station:ANTENNA868; OC_FARNELL: unknown
X320 = abracon:CRYSTAL; OC_FARNELL: unknown

## Board
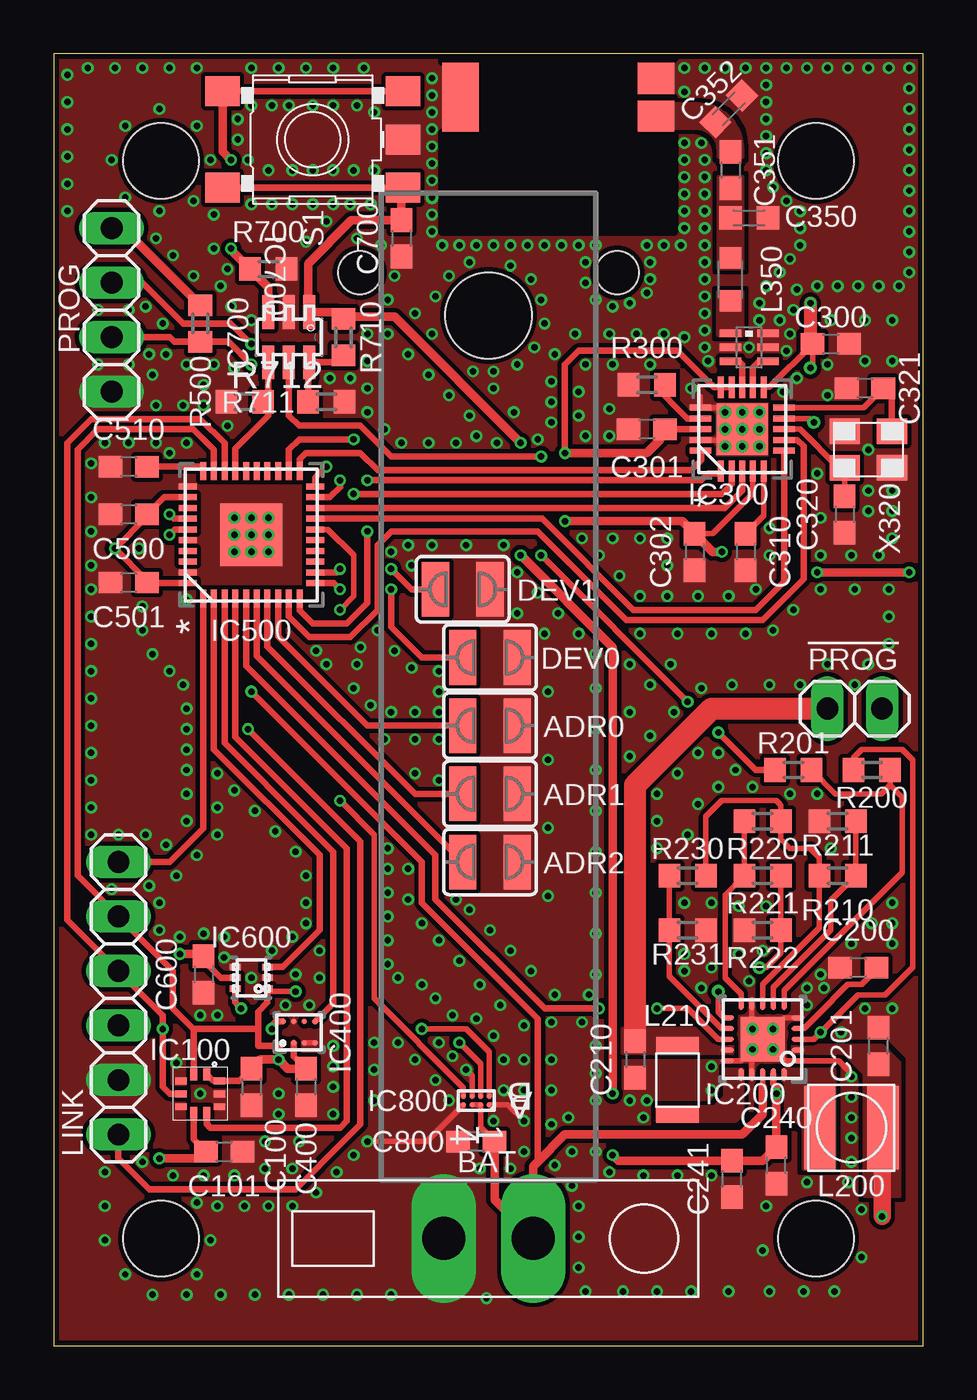
[diagram p9: board, top side]
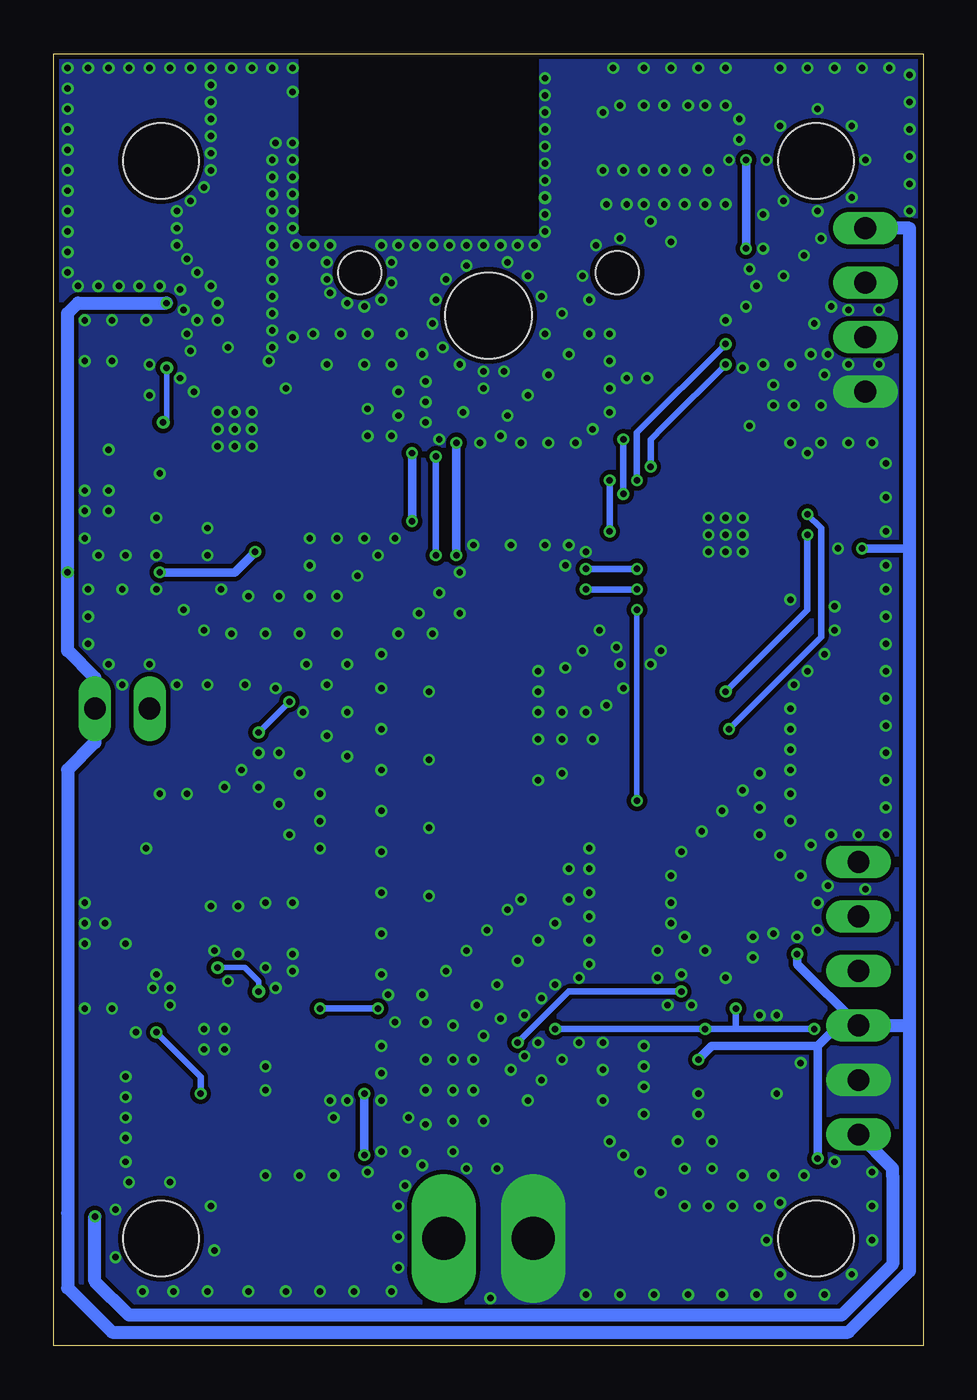
[diagram p10: board, bottom side, seen from below]

Size 40.5 x 60.2 mm. Coordinates in mm from the lower left corner, seen from the top.
Outline: 0,0 40.5,0 40.5,60.2 0,60.2 0,0
Copper layers (1*16): Top 0.018mm / dielectric 1.55mm / Bottom 0.018mm
Design rules "eC_2Layer_PClass6_BaseCopperO18_eCDefault *": minimum track width 0.15mm, minimum drill 0.3mm, track to track 0.15mm, track to pad 0.15mm, pad to pad 0.15mm, via to via 0.15mm, smd to smd 0.15mm, copper to edge 0.25mm, drill to drill 0.35mm, minimum pad ring 0.175mm, minimum via ring 0.125mm, stop-mask expansion 0mil, vias tented up to drill 0.45mm, thermal gap 0.2mm
Holes 3.5 mm at 5,5 35.5,55.2 5,55.2 35.5,5
Holes 4 mm at 20.25,48
Holes 2 mm at 26.25,50 14.25,50

### Footprints (pad centres in the part's own frame; a part is rotated, then mirrored left to right if it is on the bottom)
1X02 = drill 1.016 long: 1 -1.27,0; 2 1.27,0
SJW = smd 1.27 x 2.54: 1 -1.27,0; 2 1.27,0
IPBS-102-01-T-S-GP = drill 2 long: P$1 -2.09,0; P$2 2.09,0
C0603 = smd 1.1 x 1: 1 -0.85,0; 2 0.85,0
C0603K = smd 1.05 x 1.08: 1 -0.875,0; 2 0.875,0
2450BM15A0002 = smd 0.35 x 1: 1 -0.65,-0.875; 2 0,-0.875; 3 0.65,-0.875; 4 0.65,0.875; 5 0,0.875; 6 -0.65,0.875
LPS25H = smd 0.32 x 0.55: 1 -0.3,-0.9; 2 0.3,-0.9; 6 0.3,0.9; 7 -0.3,0.9 | smd 0.55 x 0.32: 3 0.9,-0.6; 4 0.9,0; 5 0.9,0.6; 8 -0.9,0.6; 9 -0.9,0; 10 -0.9,-0.6
RGR0020A = smd 0.61 x 0.229: 1 -1.65,1; 2 -1.65,0.5; 3 -1.65,0; 4 -1.65,-0.5; 5 -1.65,-1; 11 1.65,-1; 12 1.65,-0.5; 13 1.65,0; 14 1.65,0.5; 15 1.65,1 | smd 0.229 x 0.61: 6 -1,-1.65; 7 -0.5,-1.65; 8 0,-1.65; 9 0.5,-1.65; 10 1,-1.65; 16 1,1.65; 17 0.5,1.65; 18 0,1.65; 19 -0.5,1.65; 20 -1,1.65 | smd 2.057 x 2.057: 21 0,0
RTK20_2P4X2P4 = smd 0.991 x 0.279: 1 -1.95,1; 2 -1.95,0.5; 3 -1.95,0; 4 -1.95,-0.5; 5 -1.95,-1; 11 1.95,-1; 12 1.95,-0.5; 13 1.95,0; 14 1.95,0.5; 15 1.95,1 | smd 0.279 x 0.991: 6 -1,-1.95; 7 -0.5,-1.95; 8 0,-1.95; 9 0.5,-1.95; 10 1,-1.95; 16 1,1.95; 17 0.5,1.95; 18 0,1.95; 19 -0.5,1.95; 20 -1,1.95 | smd 2.388 x 2.388: 21 0,0
YPA0008AGAE = smd 0.254 x 0.254: A1 -0.5,0.75; A2 0.5,0.75; B1 -0.5,0.25; B2 0.5,0.25; C1 -0.5,-0.25; C2 0.5,-0.25; D1 -0.5,-0.75; D2 0.5,-0.75
RHA40_2P9X2P9 = smd 0.838 x 0.279: 1 -2.975,2.25; 2 -2.975,1.75; 3 -2.975,1.25; 4 -2.975,0.75; 5 -2.975,0.25; 6 -2.975,-0.25; 7 -2.975,-0.75; 8 -2.975,-1.25; 9 -2.975,-1.75; 10 -2.975,-2.25; 21 2.975,-2.25; 22 2.975,-1.75; 23 2.975,-1.25; 24 2.975,-0.75; 25 2.975,-0.25; 26 2.975,0.25; 27 2.975,0.75; 28 2.975,1.25; 29 2.975,1.75; 30 2.975,2.25 | smd 0.279 x 0.838: 11 -2.251,-2.975; 12 -1.75,-2.975; 13 -1.25,-2.975; 14 -0.75,-2.975; 15 -0.25,-2.975; 16 0.25,-2.975; 17 0.75,-2.975; 18 1.25,-2.975; 19 1.75,-2.975; 20 2.251,-2.975; 31 2.251,2.975; 32 1.75,2.975; 33 1.25,2.975; 34 0.75,2.975; 35 0.25,2.975; 36 -0.25,2.975; 37 -0.75,2.975; 38 -1.25,2.975; 39 -1.75,2.975; 40 -2.251,2.975 | smd 2.896 x 2.896: 41 0,0
DRL0006A = smd 0.508 x 0.305: 1 -0.75,0.5; 2 -0.75,0; 3 -0.75,-0.5; 4 0.75,-0.5; 5 0.75,0; 6 0.75,0.5
DDC0006A_N = smd 1.575 x 0.559: 1 -1.168,0.95; 2 -1.168,0; 3 -1.168,-0.95; 4 1.168,-0.95; 5 1.168,0; 6 1.168,0.95
21-0555B_W80B1-1 = smd 0.229 x 0.229: A1 -0.6,0.2; A2 -0.2,0.2; A3 0.2,0.2; A4 0.6,0.2; B1 -0.6,-0.2; B2 -0.2,-0.2; B3 0.2,-0.2; B4 0.6,-0.2
L3944 = smd 1.45 x 3.89: P$1 -1.475,0; P$2 1.475,0
L2.5X2.0 = smd 0.8 x 2: P$1 -1.6,0; P$2 1.6,0
L2012C = smd 1 x 1: 1 -1,0; 2 1,0
1X06 = drill 1.016 long: 1 -6.35,0; 2 -3.81,0; 3 -1.27,0; 4 1.27,0; 5 3.81,0; 6 6.35,0
1X04 = drill 1.016 long: 1 -3.81,0; 2 -1.27,0; 3 1.27,0; 4 3.81,0
R0603 = smd 1 x 1.1: 1 -0.85,0; 2 0.85,0
SKHMPXE010 = smd 1.6 x 1.4: 1 -4.2,2.25; 2 4.2,2.25; 3 -4.2,-2.25; 4 4.2,-2.25; 5 4.2,0
W3013-INV = smd 1.7 x 1.45: 1 0.845,2.875; 2 0.845,1.125 | smd 1.7 x 3.2: 3 9.945,2
3.2X2.5MM = smd 1.4 x 1.2: 1 -1.1,-0.85; 2 1.1,-0.85; 3 1.1,0.85; 4 -1.1,0.85

### Placement (x,y rotation side)
!PROG  37.31,29.69 180 top
ADR0  20.32,28.89 180 top
ADR1  20.32,25.72 180 top
ADR2  20.32,22.54 180 top
BAT  20.25,5 180 top
C100  9.21,12.06 270 top
C101  7.94,9.05 0 top
C200  37.47,17.62 180 top
C201  38.42,13.97 90 top
C210  27.07,13.34 270 top
C240  33.66,8.41 90 top
C241  31.59,7.78 90 top
C300  36.2,46.67 0 top
C301  27.62,42.7 180 top
C302  29.84,36.99 270 top
C310  32.23,36.99 270 top
C320  36.83,38.73 270 top
C321  37.78,44.61 180 top
C350  32.38,52.55 180 top
C351  31.51,54.77 270 top
C352  31.43,57.63 45 top
C400  11.75,12.06 270 top
C500  3.49,38.73 180 top
C501  3.49,35.56 180 top
C510  3.49,40.96 180 top
C600  6.99,17.3 270 top
C700  16.19,51.59 270 top
C800  19.68,9.53 180 top
DEV0  20.32,32.07 180 top
DEV1  19.05,35.24 180 top
F300  32.38,46.51 270 top
IC100  6.83,11.75 180 top
IC200  33.02,14.29 180 top
IC300  32.07,42.7 90 top
IC400  11.43,14.61 90 top
IC500  9.21,37.78 90 top
IC600  9.21,17.14 180 top
IC700  10.95,46.99 270 top
IC800  19.68,11.43 180 top
L200  37.15,10.16 180 top
L210  29.05,12.38 90 top
L350  31.51,49.69 90 top
LINK  3.02,16.19 90 top
PROG  2.7,48.26 270 top
R200  38.1,26.83 0 top
R201  34.45,26.83 180 top
R210  36.51,21.91 0 top
R211  36.51,24.45 0 top
R220  33.02,24.45 0 top
R221  33.02,21.91 180 top
R222  33.02,19.37 0 top
R230  29.53,21.91 0 top
R231  29.53,19.37 180 top
R300  27.62,44.77 0 top
R500  6.83,47.62 90 top
R700  10,50.16 0 top
R710  13.49,46.99 90 top
R711  12.7,43.97 180 top
R712  8.89,43.97 0 top
S1  12.06,56.2 0 top
U$1  28.89,60.17 180 top
X320  37.94,41.75 180 top

### Tracks (layer width: path | path; a pad name or v marks a point on that pad's centre or on a via)
!CC110L_CS
  Top 0.3: IC500.9 10.96,33.97 11.91,33.02 13.81,33.02 15.08,34.29 15.08,37.31 15.72,37.94 22.54,37.94 26.67,33.81 33.02,33.81 34.92,35.72 34.92,41.91 34.63,42.2 IC300.7
!HDC1000_INT
  Top 0.3: IC500.3 7.96,28.08 11.86,24.17 13.02,23.02 13.02,17.94 13.02,15.94 IC400.D2
!LINK_INT
  Top 0.3: LINK.6 5.4,22.54 6.67,23.81 6.96,24.1 IC500.1
!MAX17048_ALERT  (via drill 0.3)
  Top 0.25: IC800.B4 19.09,12.03 14.92,16.19
  Top 0.254: v13.34,25.4 14.92,23.81 14.92,16.19 | IC500.16 12.77,38.03 13.97,36.83 13.97,34.92 v13.34,34.29
  Bottom 0.254: v13.34,25.4 v13.34,34.29
!MSP430_RST  (via drill 0.3)
  Top 0.3: IC500.20 12.18,40.44 v12.7,40.96 | v9.21,45.72 8.15,46.77 R500.1 5.61,46.77 5.4,46.99 PROG.3
  Bottom 0.3: v12.7,40.96 12.7,42.23 12.06,42.86 v9.21,45.72
!TMP102_ALERT
  Top 0.3: IC500.2 7.46,27.79 12.38,22.86 12.38,19.37 10.66,17.64 IC600.3
ADRESS_0
  Top 0.3: IC500.8 10.46,33.04 14.61,28.89 ADR0.2
ADRESS_1
  Top 0.3: IC500.7 9.96,32.59 16.83,25.72 ADR1.2
ADRESS_2
  Top 0.3: ADR2.2 9.46,32.13 IC500.6
BQ25570_VBAT_OK  (via drill 0.3)
  Top 0.254: IC200.13 30.96,14.29 29.53,15.72 v28.1,15.72
  Top 0.3: v25.4,15.72 22.86,15.72 17.78,20.8 17.78,22.86 8.96,31.68 IC500.5
  Bottom 0.3: v25.4,15.72 v28.1,15.72
BQ25570_VOUT_EN
  Top 0.254: IC200.6 34.02,16.56 34.13,16.67 38.1,20.64 39.53,22.07 39.53,25.56 38.95,26.14 | 38.95,26.14 R200.2 | R201.1 36.41,25.72 36.99,25.72 38.53,25.72 38.95,26.14
BQ25570_VSTOR  (via drill 0.3)
  Top 0.254: IC200.3 35.4,14.29 v35.72,14.61 37.47,16.35 38.73,16.35 40.01,17.62 40.01,27.3 39.53,27.78 37.62,27.78 37.25,27.41 R200.1
  Top 0.3: S1.3 S1.4 | IC200.19 33.52,12.2 33.66,12.06
  Top 0.305: 11.85,48.16 IC700.1 | 13.18,48.16 R710.2
  Top 0.406: IC700.1 13.18,48.16 | 11.85,48.16 11.85,50.43 13.87,52.44 C700.1 16.19,53.88 S1.4 | 33.66,12.06 v33.66,11.75 C240.2 33.02,8.63 C241.2 26.3,8.63 v26.04,8.89 | v26.04,11.75 26.04,32.54 v21.75,36.83 | v21.75,42.07 15.88,47.94 13.6,47.94 R710.2
  Bottom 0.3: v33.66,11.75 33.66,12.54 v35.72,14.61
  Bottom 0.406: v26.04,8.89 v26.04,11.75 | v21.75,36.83 v21.75,42.07
CC110L_GDO0
  Top 0.3: IC300.6 34.02,35.6 32.7,34.29 26.99,34.29 22.75,38.53 IC500.17
CC110L_GDO2
  Top 0.3: IC300.3 32.07,39.85 31.25,39.03 IC500.18
DEVICE_0  (via drill 0.3)
  Top 0.3: IC500.11 13.05,35.53 v13.34,35.24 | v15.72,35.24 15.72,33.5 17.14,32.07 DEV0.2
  Bottom 0.3: v13.34,35.24 v15.72,35.24
DEVICE_1  (via drill 0.3)
  Top 0.3: IC500.12 13.17,36.03 v13.34,36.2 | v15.72,36.2 16.67,35.24 DEV1.2
  Bottom 0.3: v13.34,36.2 v15.72,36.2
GND  (via drill 0.3, 0.3 pad 0.6)
  Top 0.25: IC800.A1 21.16,11.23 | IC800.A4 17.38,9.53 | IC800.B3 19.48,12.58 v19.21,12.86
  Top 0.254: IC200.1 34.02,13.29 v33.5,13.81 IC200.21 | IC200.5 34.02,15.29 v33.5,14.76 IC200.21 | IC200.15 32.02,13.29 v32.54,13.81 | v32.54,13.81 IC200.21 | IC300.21 31.57,42.2 IC300.19 | 30.12,44.23 IC300.16 31.07,43.7 v31.27,43.5 | IC200.17 32.52,13.79 v32.54,13.81 | IC400.D1 IC400.C1 | IC200.1 34.97,13.29 | IC200.9 32.52,14.79 IC200.21 | IC200.1 36.56,13.29 37.15,12.7 | 21.16,11.23 v21.91,10.48 | 17.38,9.53 v14.61,9.53
  other vias: 32.38,16.99 32.07,42.7 31.27,42.7 31.27,41.91 32.07,41.91 32.07,43.5 32.86,43.5 32.86,42.7 32.86,41.91 32.54,14.76 7.94,18.1 6.83,11.75 24.45,51.28 30.16,56.04 17.62,59.05 17.62,58.26 17.62,57.47 17.62,56.67 17.62,55.88 17.62,55.09 17.62,54.29 29.37,58.42 30.48,45.88 17.62,51.91 29.37,59.53 17.62,52.7 17.62,53.5 27.62,51.28 23.65,51.28 27.78,50.48 24.77,49.53 34.29,47.15 32.38,46.51 28.42,51.28 25.24,51.28 7.3,55.24 30.32,59.53 31.27,59.53 13.81,45.09 5.56,50.8 8.26,48.42 12.86,45.09 37.94,41.75 36.04,45.72 29.69,44.61 30.64,11.91 30.64,13.02 29.21,51.28 25.24,32.23 34.13,46.35 28.57,37.62 15.24,51.28 25.24,30.64 24.61,37.62 27.3,37.62 25.88,43.66 27.3,34.92 25.4,36.83 31.43,34.92 30,34.92 32.7,35.24 37.94,39.85 37.15,36.83 35.72,36.83 27.3,33.18 30.16,30.64 28.73,31.75 7.62,15.4 6.83,15.4 15.56,23.18 16.51,20.8 17.14,19.68 29.05,7.94 27.46,7.94 30,25.24 29.53,23.81 37.15,12.54 37.15,11.59 37.15,10.64 37.15,9.68 37.15,8.57 24.77,2.54 26.51,2.54 18.1,51.28 22.86,51.28 22.07,51.28 21.27,51.28 20.48,51.28 19.68,51.28 18.89,51.28 15.56,21.11 15.72,2.38 14.13,2.38 12.54,2.38 13.18,8.1 31.43,2.54 33.34,2.54 24.45,3.65 28.1,2.54 33.18,6.51 29.69,2.54 33.02,4.45 26.04,37.62 26.35,35.88 37.15,18.73 35.72,38.58 35.56,40.64 39.05,39.85 37.94,38.89 33.97,44.45 36.04,44.29 36.2,47.78 37.78,47.78 39.05,47.78 37.78,45.88 34.61,45.09 5.71,13.18 9.21,37.78 8.41,38.58 9.21,38.58 10,38.58 8.41,37.78 10,37.78 8.41,36.99 9.21,36.99 10,36.99 17.94,18.89 18.89,17.94 19.84,16.83 20.8,15.88 21.91,14.92 23.18,15.08 24.61,15.08 25.24,13.97 25.24,12.7 25.24,11.43 26.83,11.43 27.62,11.43 27.46,10.64 23.97,10.64 23.18,10.32 21.91,9.05 21.27,8.26 23.34,8.41 24.13,9.05 25.24,9.05 25.88,8.1 30.64,7.94 35.08,7.62 36.99,7.62 37.62,6.35 37.62,4.13 36.35,2.54 34.92,2.54 24.45,5.08 24.45,6.51 24.13,7.46 10.95,2.38 9.37,2.38 7.78,2.38 6.19,2.38 4.6,2.38 3.33,3.33 2.38,4.92 2.38,6.51 2.38,8.1 4.13,8.57 5.56,7.94 6.67,3.33 7.3,4.92 6.67,6.67 6.99,7.94 9.84,9.53 9.84,8.26 8.41,7.94 11.43,9.53 11.11,8.26 14.92,11.43 14.92,14.13 14.92,12.86 16.03,14.13 16.51,22.23 15.56,20 15.56,22.23 36.67,14.61 39.05,15.72 37.78,15.72 35.08,15.88 35.08,16.67 35.72,17.3 35.88,16.67 39.05,18.73 38.1,19.68 39.05,20.64 39.05,19.68 31.91,18.26 33.02,18.41 31.91,20.48 33.18,20.48 29.37,20.64 30.64,20.64 29.37,18.26 29.37,17.46 30.16,16.67 30.64,17.62 28.1,23.18 28.1,24.45 28.1,25.72 29.05,26.67 30,27.62 30.96,27.62 31.75,26.83 32.54,26.04 30.96,26.04 34.29,25.72 35.56,25.72 36.2,23.18 26.83,31.75 26.83,29.53 26.83,27.46 27.78,28.42 28.89,29.53 27.78,30.8 31.59,30.8 33.34,30.8 34.77,30.8 36.04,31.75 37.31,30.8 37.94,31.75 38.89,32.7 38.89,33.97 38.89,35.24 37.31,35.24 35.72,35.24 34.45,34.29 33.5,33.34 32.23,33.18 30.64,33.18 29.05,33.18 28.57,34.92 33.34,38.1 33.34,36.83 28.57,36.35 27.78,45.72 26.04,45.72 24.77,45.72 24.45,44.45 24.45,43.34 24.77,42.39 25.88,42.39 29.37,56.04 29.37,55.24 29.37,54.45 29.37,53.66 29.37,52.86 29.37,52.07 30.32,55.24 30.32,54.45 30.32,53.66 30.32,52.86 30.32,52.07 30.32,51.28 30.32,50.48 30.32,49.69 30.32,48.9 30.32,48.1 30.32,47.31 30.32,46.51 32.23,59.53 33.18,59.53 34.13,59.53 35.08,59.53 36.04,59.53 33.18,58.74 33.18,57.94 33.18,57.15 33.18,56.36 33.18,55.56 33.18,54.77 33.5,53.98 34.13,53.34 34.77,52.86 34.77,52.07 34.77,51.28 34.29,50.64 33.81,50.01 33.18,49.37 32.86,48.58 32.86,47.78 33.81,47.78 34.45,48.26 34.61,49.21 35.56,49.37 36.51,49.37 37.47,49.37 38.42,49.37 39.37,49.37 39.85,50.01 39.85,50.96 39.85,51.91 39.85,52.86 39.85,53.82 39.85,54.77 39.85,55.72 39.85,56.67 39.85,57.63 39.85,58.58 39.85,59.53 36.99,59.53 37.94,59.53 38.89,59.53 39.05,45.88 38.42,36.83 39.05,37.62 39.05,38.89 25.24,28.73 25.24,26.83 25.24,24.92 25.24,23.02 25.24,21.11 25.24,19.21 25.24,17.3 24.92,16.35 23.34,16.35 22.23,17.46 21.27,18.41 20.32,19.37 19.37,20.32 18.73,20.8 16.83,26.67 17.94,26.35 17.94,28.26 17.94,31.43 16.83,28.26 15.4,28.26 12.7,31.75 13.97,30.64 14.76,29.84 15.72,29.53 17.94,29.53 16.83,29.53 17.94,30.48 15.88,32.38 12.22,32.38 14.13,31.75 14.29,32.54 16.67,31.59 15.08,33.34 22.86,33.18 21.59,34.13 15.72,36.99 16.51,37.31 17.62,37.31 19.21,37.31 20.95,37.31 16.67,36.35 21.59,36.04 22.54,35.08 23.5,34.13 24.45,33.18 7.62,26.67 7.62,25.08 7.62,23.81 6.67,22.86 5.71,21.91 4.45,21.43 2.7,21.27 4.92,20.64 4.92,19.37 5.87,19.05 6.99,19.21 7.94,19.05 9.21,17.14 11.11,19.05 10.16,18.41 11.75,19.68 11.75,20.64 11.75,21.91 11.27,23.02 8.41,25.88 9.37,24.92 10.32,23.97 12.38,17.14 10.79,15.88 11.91,15.88 12.38,18.41 11.27,17.3 13.02,13.97 13.02,13.02 13.02,12.06 10.48,10.79 10.48,11.75 13.02,10.79 1.75,23.81 1.75,25.08 1.75,26.35 1.75,27.62 1.75,28.89 1.75,30.16 1.75,31.43 1.75,32.7 1.75,33.97 1.75,35.24 1.75,36.35 1.75,37.94 1.75,39.53 1.75,41.12 2.38,42.07 3.49,42.07 4.76,42.07 6.19,42.07 5.4,41.59 3.02,23.81 4.29,23.81 5.24,23.34 6.19,24.45 6.19,27.78 5.4,31.43 4.13,33.34 6.19,34.77 3.97,37.15 4.13,34.45 6.19,25.72 6.19,28.73 6.03,30.8 6.19,26.83 6.19,29.69 4.6,32.23 8.1,42.86 4.6,45.24 6.99,44.77 8.41,45.56 7.46,45.72 6.19,45.72 5.24,46.2 4.45,46.2 3.49,45.72 4.76,43.81 6.03,43.81 6.99,43.81 2.06,45.72 19.68,42.39 16.83,48.1 19.37,43.34 18.41,44.29 17.46,45.24 16.51,46.2 15.56,47.15 14.61,47.15 14.61,45.88 14.61,44.61 14.61,43.5 15.4,42.7 16.19,42.07 17.46,42.07 18.73,42.07 20.64,42.07 2.06,48.26 3.49,48.26 4.29,48.42 5.08,47.62 6.51,49.85 4.76,51.59 0.64,52.86 0.64,54.13 0.64,55.4 0.64,56.67 0.64,57.94 0.64,59.21 1.59,59.53 2.86,59.53 4.13,59.53 5.4,59.53 6.67,59.53 9.21,59.53 8.57,56.2 10,54.77 6.51,53.34 4.92,52.86 3.33,53.5 2.7,55.24 3.33,56.83 4.92,57.63 6.67,56.83 7.78,49.37 9.21,47.78 11.75,51.44 12.7,52.39 9.21,53.18 9.05,55.24 8.57,57.15 9.21,57.78 11.75,59.53 13.02,59.53 10.48,59.53 13.81,53.18 10.16,53.18 14.45,59.53 11.11,54.77 13.02,54.77 12.06,54.77 13.02,53.18 11.11,53.18 14.13,51.59 15.88,49.85 14.76,53.18 12.06,53.18 13.97,54.77 24.77,50.48 15.56,48.74 17.62,47.15 20.48,44.61 19.53,45.4 21.59,45.72 20.48,45.4 21.43,43.5 23.18,43.97 22.54,42.23 23.18,43.02 23.18,44.93 23.34,46.2 24.29,47.15 25.88,47.15 27.15,47.15 28.42,47.15 29.37,46.99 23.02,30.48 23.02,27.3 23.02,24.13 23.02,20.95 21.91,11.91 21.91,13.34 23.18,13.34 23.18,11.91 12.22,7.14 13.97,8.89 11.11,6.51 10,6.51 8.89,6.51 7.62,6.51 15.56,18.89 15.56,17.78 16.03,17.14 17.14,16.83 17.78,16.19 18.57,15.4 19.68,15.24 20.48,14.45 20.95,13.34 18.57,13.49 17.94,14.13 20.95,11.91 20.48,10.48 16.83,13.34 17.78,12.38 18.41,11.43 19.84,8.26 20.16,2.22 17.78,48.9 18.41,49.85 19.37,50.48 14.92,54.77 21.27,50.32 22.23,49.69 22.7,48.74 22.86,47.62 22.38,46.51 25.24,48.74 26.04,48.42 26.83,48.58 27.62,49.05 27.78,49.69 14.92,57.47 14.13,57.78 13.02,57.78 12.06,57.78 10.95,57.78 10.16,57.78 7.46,52.7 7.46,51.12 8.1,50.16
  pour Top (isolate 0.2, rank 3, no thermals): 0,60.17 0,0 40.64,0 40.64,60.17
  pour Bottom (isolate 0.2, no thermals): 0,60.17 0,0 40.64,0 40.64,60.17
  pour Top (isolate 0.2, rank 2, no thermals): 16.19,60.17 16.19,50.64 27.94,50.64 27.94,48.42 28.73,46.2 34.29,46.2 34.13,53.98 34.13,60.17
LPS25H_INT
  Top 0.3: IC500.4 8.46,28.37 13.65,23.18 13.65,10.48 13.34,10.16 11.43,10.16 7.3,10.16 7.13,10.34 IC100.7
MSP430_CLK  (via drill 0.3)
  Top 0.3: IC500.10 11.46,34.26 12.06,33.66 13.65,33.66 14.61,34.61 v14.61,37.94 | IC300.1 31.07,40.64 30.48,40.64 30.16,40.32 v14.61,40.32
  Bottom 0.3: v14.61,40.32 v14.61,37.94
MSP430_MISO  (via drill 0.3)
  Top 0.3: IC500.22 10.96,41.76 11.43,42.23 v13.97,42.23 | v13.97,39.69 31.11,39.69 31.43,40.01 31.57,40.14 IC300.2
  Bottom 0.3: v13.97,42.23 v13.97,39.69
MSP430_MOSI
  Top 0.3: IC500.21 11.46,41.3 11.75,41.59 13.34,41.59 14.29,41.59 15.08,40.8 29.69,40.8 30.16,41.27 30.16,41.66 IC300.20
MSP430_SCL  (via drill 0.3)
  Top 0.25: IC800.B2 19.89,13.13 v18.89,14.13 | v11.27,16.51 10.09,16.51 IC600.1
  Top 0.3: IC500.29 7.46,41.76 6.51,42.7 2.06,42.7 1.11,41.75 1.11,21.91 LINK.5 5.56,17.46 5.56,15.72 6.53,14.75 | 9.53,14.76 9.53,13.97 10.54,13.97 IC400.A1 | 9.53,14.76 9.53,15.56 9.96,15.99 IC600.1 | IC100.2 6.53,14.75 | 6.53,14.75 6.54,14.76 9.53,14.76
  Bottom 0.3: v11.27,16.51 16.51,16.51 v18.89,14.13
MSP430_SDA  (via drill 0.3)
  Top 0.25: IC800.B1 20.29,13.69 19.21,14.76 v17.14,14.76
  Top 0.254: 10.66,15.11 IC400.A2
  Top 0.3: IC500.28 7.96,42.05 6.83,43.18 1.75,43.18 0.64,42.07 0.64,19.84 LINK.4 5.08,15.4 v5.08,14.76 5.08,12.06 5.4,11.75 IC100.4 | v10.16,14.76 10.16,14.92 10.34,15.11 10.66,15.11 | IC600.6 8.46,15.99 v8.73,15.72
  Bottom 0.3: v5.08,14.76 8.73,14.76 | 8.73,14.76 v10.16,14.76 v17.14,14.76 | 8.73,14.76 v8.73,15.72
MSP430_TEST  (via drill 0.3)
  Top 0.3: IC500.19 12.86,39.53 13.34,40.01 v13.34,40.32 | v9.21,46.67 8.26,47.62 6.03,47.62 4.13,49.53 PROG.2
  Bottom 0.3: v13.34,40.32 13.34,42.55 v9.21,46.67
MSP430_VCORE
  Top 0.3: IC500.30 6.96,40.96 C510.1
N$1
  pour Top (isolate 0.2, no thermals): 30.96,55.4 32.06,55.4 32.06,55.74 arc90 29.96,57.84 27.29,57.84 27.29,56.74 29.96,56.74 arc-90 30.96,55.74
N$2
  pour Top (isolate 0.2, no thermals): 30.96,49.09 32.06,49.09 32.06,47.08 30.96,47.08
N$7  (via drill 0.3)
  Top 0.3: S1.1 S1.2
  Top 0.406: IC700.3 10,49.31 R700.1 8.26,51.06 v8.26,51.12 | v8.26,55.24 7.87,55.63 S1.1
  Bottom 0.406: v8.26,51.12 v8.26,55.24
N$14
  Top 0.254: R220.1 R221.2 31.27,21.01 31.27,17.3 31.27,17.14 32.02,16.4 IC200.10
N$15
  Top 0.254: IC200.8 33.02,16.83 33.66,17.46 35.24,19.05 35.66,19.47 R210.1 35.66,22.76 35.24,23.18 34.29,23.18 33.97,23.5 33.87,23.6 R220.2 33.87,25.18 33.81,25.24 33.66,25.4 33.34,25.4 31.11,25.4 30.38,24.66 R230.2
N$16
  Top 0.254: R211.2 R210.2 36.2,20.74 36.2,20 36.2,19.37 33.66,16.83 33.52,16.69 IC200.7
N$17  (via drill 0.3 pad 0.6)
  Top 0.254: IC200.11 31.23,15.29 30.96,15.56 v30.96,16.51 | R221.1 R222.2 33.87,18.31 33.18,17.62 v32.86,17.62
  Bottom 0.254: v30.96,16.51 30.96,16.99 31.59,17.62 v32.86,17.62
N$18
  pour Top (no thermals): 33.97,12.86 33.97,11.11 34.92,10.16 34.92,8.26 36.35,8.26 36.35,12.86
N$19
  Top 0.254: IC200.4 34.95,14.79 35.56,15.4 36.99,16.83 37.62,16.83 37.68,16.88 38.31,17.52 C200.1
N$21
  Top 0.254: R230.1 R231.2 28.68,17.2 30.96,14.92 31.09,14.79 IC200.12
N$22
  Top 1.016: C210.1 27.07,26.12 28.57,27.62 30.64,29.69 !PROG.2
  pour Top (no thermals): 31.59,13.65 31.59,13.97 30.64,13.97 29.84,14.76 26.51,14.76 26.51,13.65
N$25
  pour Top (no thermals): 32.07,10.79 32.07,12.86 31.27,12.86 31.27,11.59 30.8,11.11 28.1,11.11 28.1,10.48 31.75,10.48
N$29
  Top 0.254: X320.3 36.41,40.9 | IC300.8 34.77,42.7 36.57,40.9 X320.3 | X320.3 C320.1
N$34
  Top 0.3: IC300.13 32.07,45.31 32.07,45.56 32.07,45.72 31.92,45.86 F300.3
N$35
  Top 0.3: IC300.12 32.57,45.59 32.86,45.88 33.24,45.88 F300.4
N$36
  pour Top (isolate 0.2, no thermals): 32.06,54.45 32.06,50.21 30.96,50.21 30.96,54.45
N$40
  Top 0.254: IC300.5 33.07,38.68 C310.1
N$41
  Top 0.3: IC300.17 29.5,43.2 28.89,43.81 28.47,44.23 R300.2
N$49
  Top 0.254: IC300.10 35.67,43.7 37.73,43.7 C321.1
  Top 0.3: C321.1 39.04,44.2 X320.1
SOLAR_P  (via drill 0.3)
  Top 0.3: IC500.34 5.6,38.53 v5.4,38.73 | v9.05,28.73 14.29,23.5 14.29,14.13 14.29,10.32 13.49,9.53 11.27,7.3 4.45,7.3 3.02,8.73 LINK.1
  Top 0.813: v38.58,6.03 38.58,10.16 L200.P$1
  Bottom 0.3: v5.4,38.73 4.76,38.1 4.76,36.99 4.76,33.02 v9.05,28.73
  Bottom 0.6: v38.58,6.03 38.58,3.02 36.99,1.43 3.81,1.43 1.43,3.81 1.43,7.94 1.43,8.26 LINK.1
  pour Top (no thermals): 37.78,6.99 39.37,6.99 39.37,13.18 38.58,13.97 34.45,13.97 34.45,13.65 36.83,13.65 37.78,12.7
TPL5010_RST_N
  Top 0.305: R710.1 13.18,45.82 IC700.6 11.85,45.77 R711.2
TPL5111_DONE
  Top 0.3: IC500.27 8.46,41.8 10,43.34 10,44.13 IC700.4
  Top 0.406: R712.2 10,44.13
TPL5111_DRV  (via drill 0.3)
  Top 0.3: 10.95,44.77 IC700.5 10.95,43.34 11.43,42.86 14.29,42.86 15.72,41.43 v22.7,41.43 | R201.2 32.7,26.83 v30.96,28.57 | v29.53,30 v22.7,36.83
  Bottom 0.3: v30.96,28.57 v29.53,30 | v22.7,36.83 v22.7,41.43
VBAT  (via drill 0.3)
  Top 0.25: IC800.A3 IC800.A2 19.89,10.18
  Top 0.254: 33.02,12.06 IC200.18 | 19.89,10.18 C800.1
  Top 0.3: IC500.35 5.65,38.03 v5.4,37.78 | v9.21,30.48 17.14,22.54 17.14,20.64 22.54,15.24 22.54,8.57
  Top 0.406: 33.02,12.06 33.02,10.79 32.07,9.84 23.81,9.84 22.54,8.57 22.34,8.37 BAT.P$1 20.54,6.8 C800.1
  Bottom 0.3: v5.4,37.78 5.4,34.29 v9.21,30.48
VCC  (via drill 0.3, 0.3 pad 0.6)
  Top 0.254: IC300.11 33.33,44.65 C300.1 35.34,45.66 v35.24,45.56 | IC300.4 32.57,39.77 32.57,39.71 31.75,38.89 30.7,37.84 C302.1 | IC100.1 7.43,12.35 IC100.10 | IC300.9 35.22,43.2 v35.4,43.02
  Top 0.3: IC300.14 IC300.15 30.75,44.65 30.64,44.77 30.16,45.24 29.21,46.2 29.05,46.35 26.35,46.35 24.45,46.35 23.81,45.72 23.81,41.91 v23.81,41.59 | IC300.18 C301.1 | IC500.32 5.14,39.53 C500.1 4.34,38.63 v2.86,37.15 4.34,35.66 C501.1 4.37,35.53 IC500.40 | C600.1 6.99,17.94 7.78,17.14 IC600.5 | C400.1 11.18,13.48 IC400.B1 | IC100.10 8.64,12.35 C100.1 | IC100.6 6.53,9.61 C101.1
  Top 0.406: v5.87,18.26 6.99,18.26 C600.1 | C400.1 10.9,12.91 v10.48,13.34 9.63,13.34 C100.1 | v4.92,8.73 7.09,8.73 C101.1 | PROG.1 3.23,52.07 R500.2 | v31.11,36.99 30.7,36.99 C302.1 29.27,38.42 v23.81,38.42 | v23.81,41.59 27.62,41.59 28.26,42.23 28.26,42.49 C301.1 | v39.85,36.04 v35.56,36.04
  Top 0.6: v35.24,48.58 35.24,46.77 C300.1
  Bottom 0.254: v35.4,43.02 35.24,43.18 v35.24,45.56
  Bottom 0.406: 0.64,37.15 v2.86,37.15 | v5.87,18.26 5.87,17.78 LINK.3 3.97,14.92 4.92,13.97 | v10.48,13.34 9.84,13.97 4.92,13.97 | 4.92,13.97 v4.92,8.73 | 39.85,35.53 v39.85,36.04 | v23.81,38.42 v23.81,41.59 | v35.56,36.04 32.07,36.04 v31.11,36.99
  Bottom 0.6: 0.64,14.92 0.64,3.49 3.49,0.64 37.78,0.64 39.85,2.7 39.85,6.19 39.85,26.83 38.58,28.1 !PROG.1 38.58,31.11 39.85,32.38 39.85,35.53 v39.85,36.04 39.85,47.94 39.85,48.1 39.37,48.58 v35.24,48.58 | 0.64,14.92 0.64,37.15 0.64,52.07 PROG.1 | LINK.3 0.64,14.92